# EAGLE design AJH_module_tester-v1_00 (EAGLE 9.6.2)

## Sheet 1 of 4
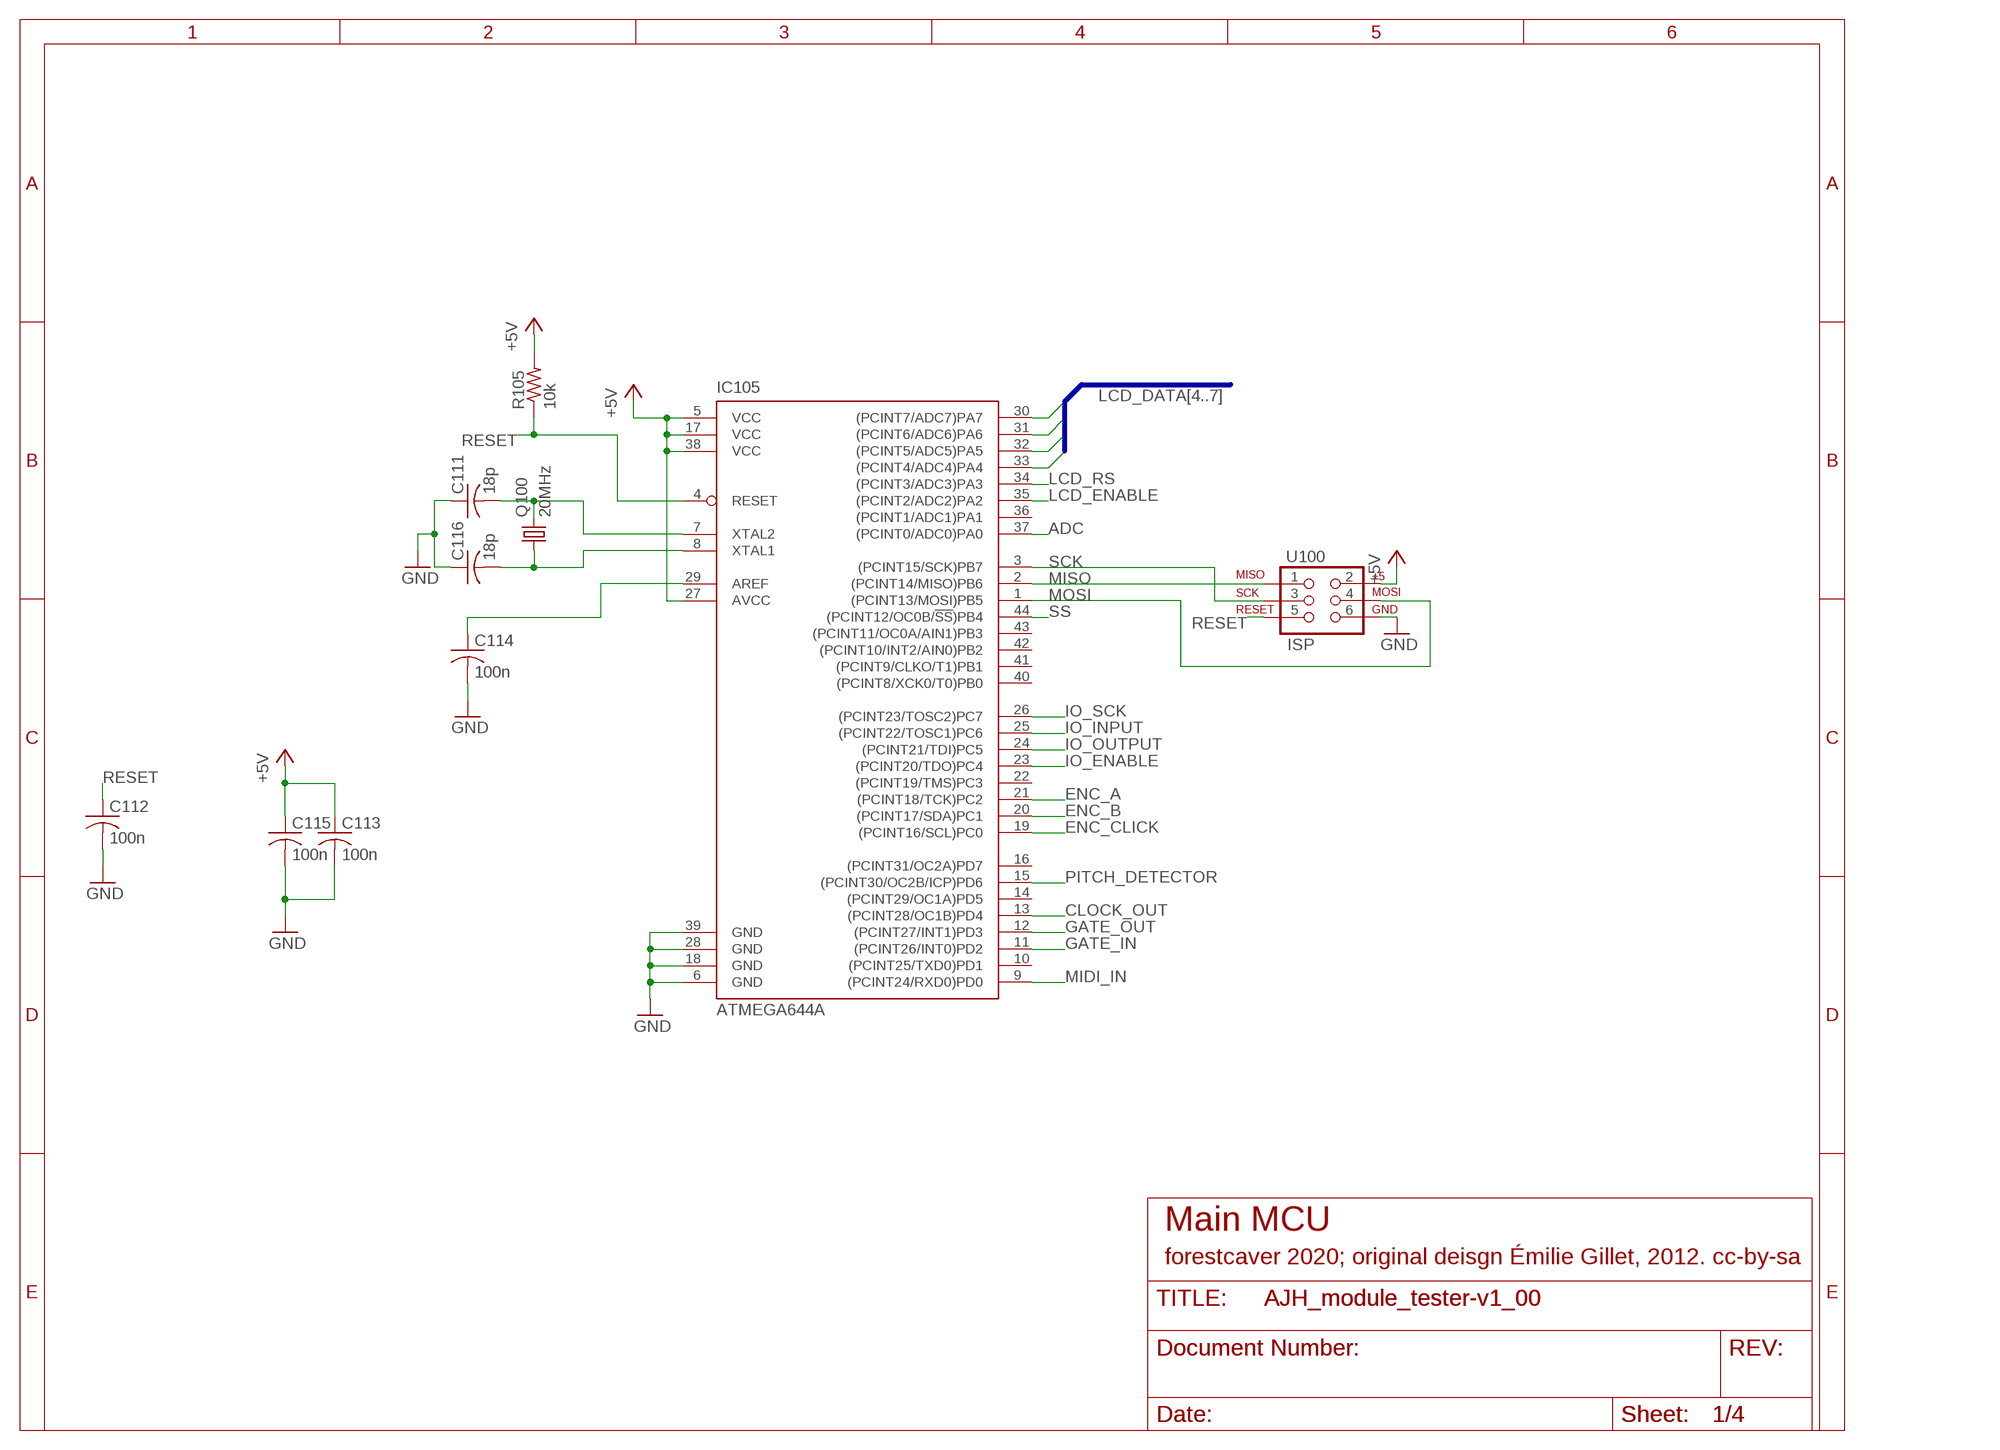
[diagram p0: schematic, sheet 1]

### Parts
C111  18p  C-USC0603  [C0603]
C112  100n  C-USC0603  [C0603]
C113  100n  C-USC0603  [C0603]
C114  100n  C-USC0603  [C0603]
C115  100n  C-USC0603  [C0603]
C116  18p  C-USC0603  [C0603]
IC105  ATMEGA644A  [TQFP44]
Q100  20MHz  CRYSTALHC49UP  [HC49UP]
R105  10k  R-US_R0603  [R0603]
U100  ISP  AVR_SPI_PRG_6PTH  [2X3]

### Nets
+5V: C113.1 C115.1 IC105.5(VCC) IC105.17(VCC) IC105.27(AVCC) IC105.38(VCC) R105.2 U100.2 ; also sheet 2,3,4
ADC: IC105.37((PCINT0/ADC0)PA0) ; also sheet 3
CLOCK_OUT: IC105.13((PCINT28/OC1B)PD4) ; also sheet 2
ENC_A: IC105.21((PCINT18/TCK)PC2) ; also sheet 2
ENC_B: IC105.20((PCINT17/SDA)PC1) ; also sheet 2
ENC_CLICK: IC105.19((PCINT16/SCL)PC0) ; also sheet 2
GATE_IN: IC105.11((PCINT26/INT0)PD2) ; also sheet 2
GATE_OUT: IC105.12((PCINT27/INT1)PD3) ; also sheet 2
GND: C111.1 C112.2 C113.2 C114.2 C115.2 C116.1 IC105.6(GND) IC105.18(GND) IC105.28(GND) IC105.39(GND) U100.6 ; also sheet 2,3,4
IO_ENABLE: IC105.23((PCINT20/TDO)PC4) ; also sheet 2
IO_INPUT: IC105.25((PCINT22/TOSC1)PC6) ; also sheet 2
IO_OUTPUT: IC105.24((PCINT21/TDI)PC5) ; also sheet 2
IO_SCK: IC105.26((PCINT23/TOSC2)PC7) ; also sheet 2
LCD_DATA4: IC105.33((PCINT4/ADC4)PA4) ; also sheet 2
LCD_DATA5: IC105.32((PCINT5/ADC5)PA5) ; also sheet 2
LCD_DATA6: IC105.31((PCINT6/ADC6)PA6) ; also sheet 2
LCD_DATA7: IC105.30((PCINT7/ADC7)PA7) ; also sheet 2
LCD_ENABLE: IC105.35((PCINT2/ADC2)PA2) ; also sheet 2
LCD_RS: IC105.34((PCINT3/ADC3)PA3) ; also sheet 2
MIDI_IN: IC105.9((PCINT24/RXD0)PD0) ; also sheet 2
MISO: IC105.2((PCINT14/MISO)PB6) U100.1
MOSI: IC105.1((PCINT13/MOSI)PB5) U100.4 ; also sheet 3
N$4: C116.2 IC105.8(XTAL1) Q100.1
N$20: C111.2 IC105.7(XTAL2) Q100.2
N$22: C114.1 IC105.29(AREF)
PITCH_DETECTOR: IC105.15((PCINT30/OC2B/ICP)PD6) ; also sheet 3
RESET: C112.1 IC105.4(RESET) R105.1 U100.5
SCK: IC105.3((PCINT15/SCK)PB7) U100.3 ; also sheet 3
SS: IC105.44((PCINT12/OC0B/!SS!)PB4) ; also sheet 3
Unconnected: IC105.10((PCINT25/TXD0)PD1) IC105.14((PCINT29/OC1A)PD5) IC105.16((PCINT31/OC2A)PD7) IC105.22((PCINT19/TMS)PC3) IC105.36((PCINT1/ADC1)PA1) IC105.40((PCINT8/XCK0/T0)PB0) IC105.41((PCINT9/CLKO/T1)PB1) IC105.42((PCINT10/INT2/AIN0)PB2) IC105.43((PCINT11/OC0A/AIN1)PB3)

### Buses
LCD_DATA[4..7]

### Notes on the sheet
- Main MCU
- forestcaver 2020; original deisgn Émilie Gillet, 2012. cc-by-sa

## Sheet 2 of 4
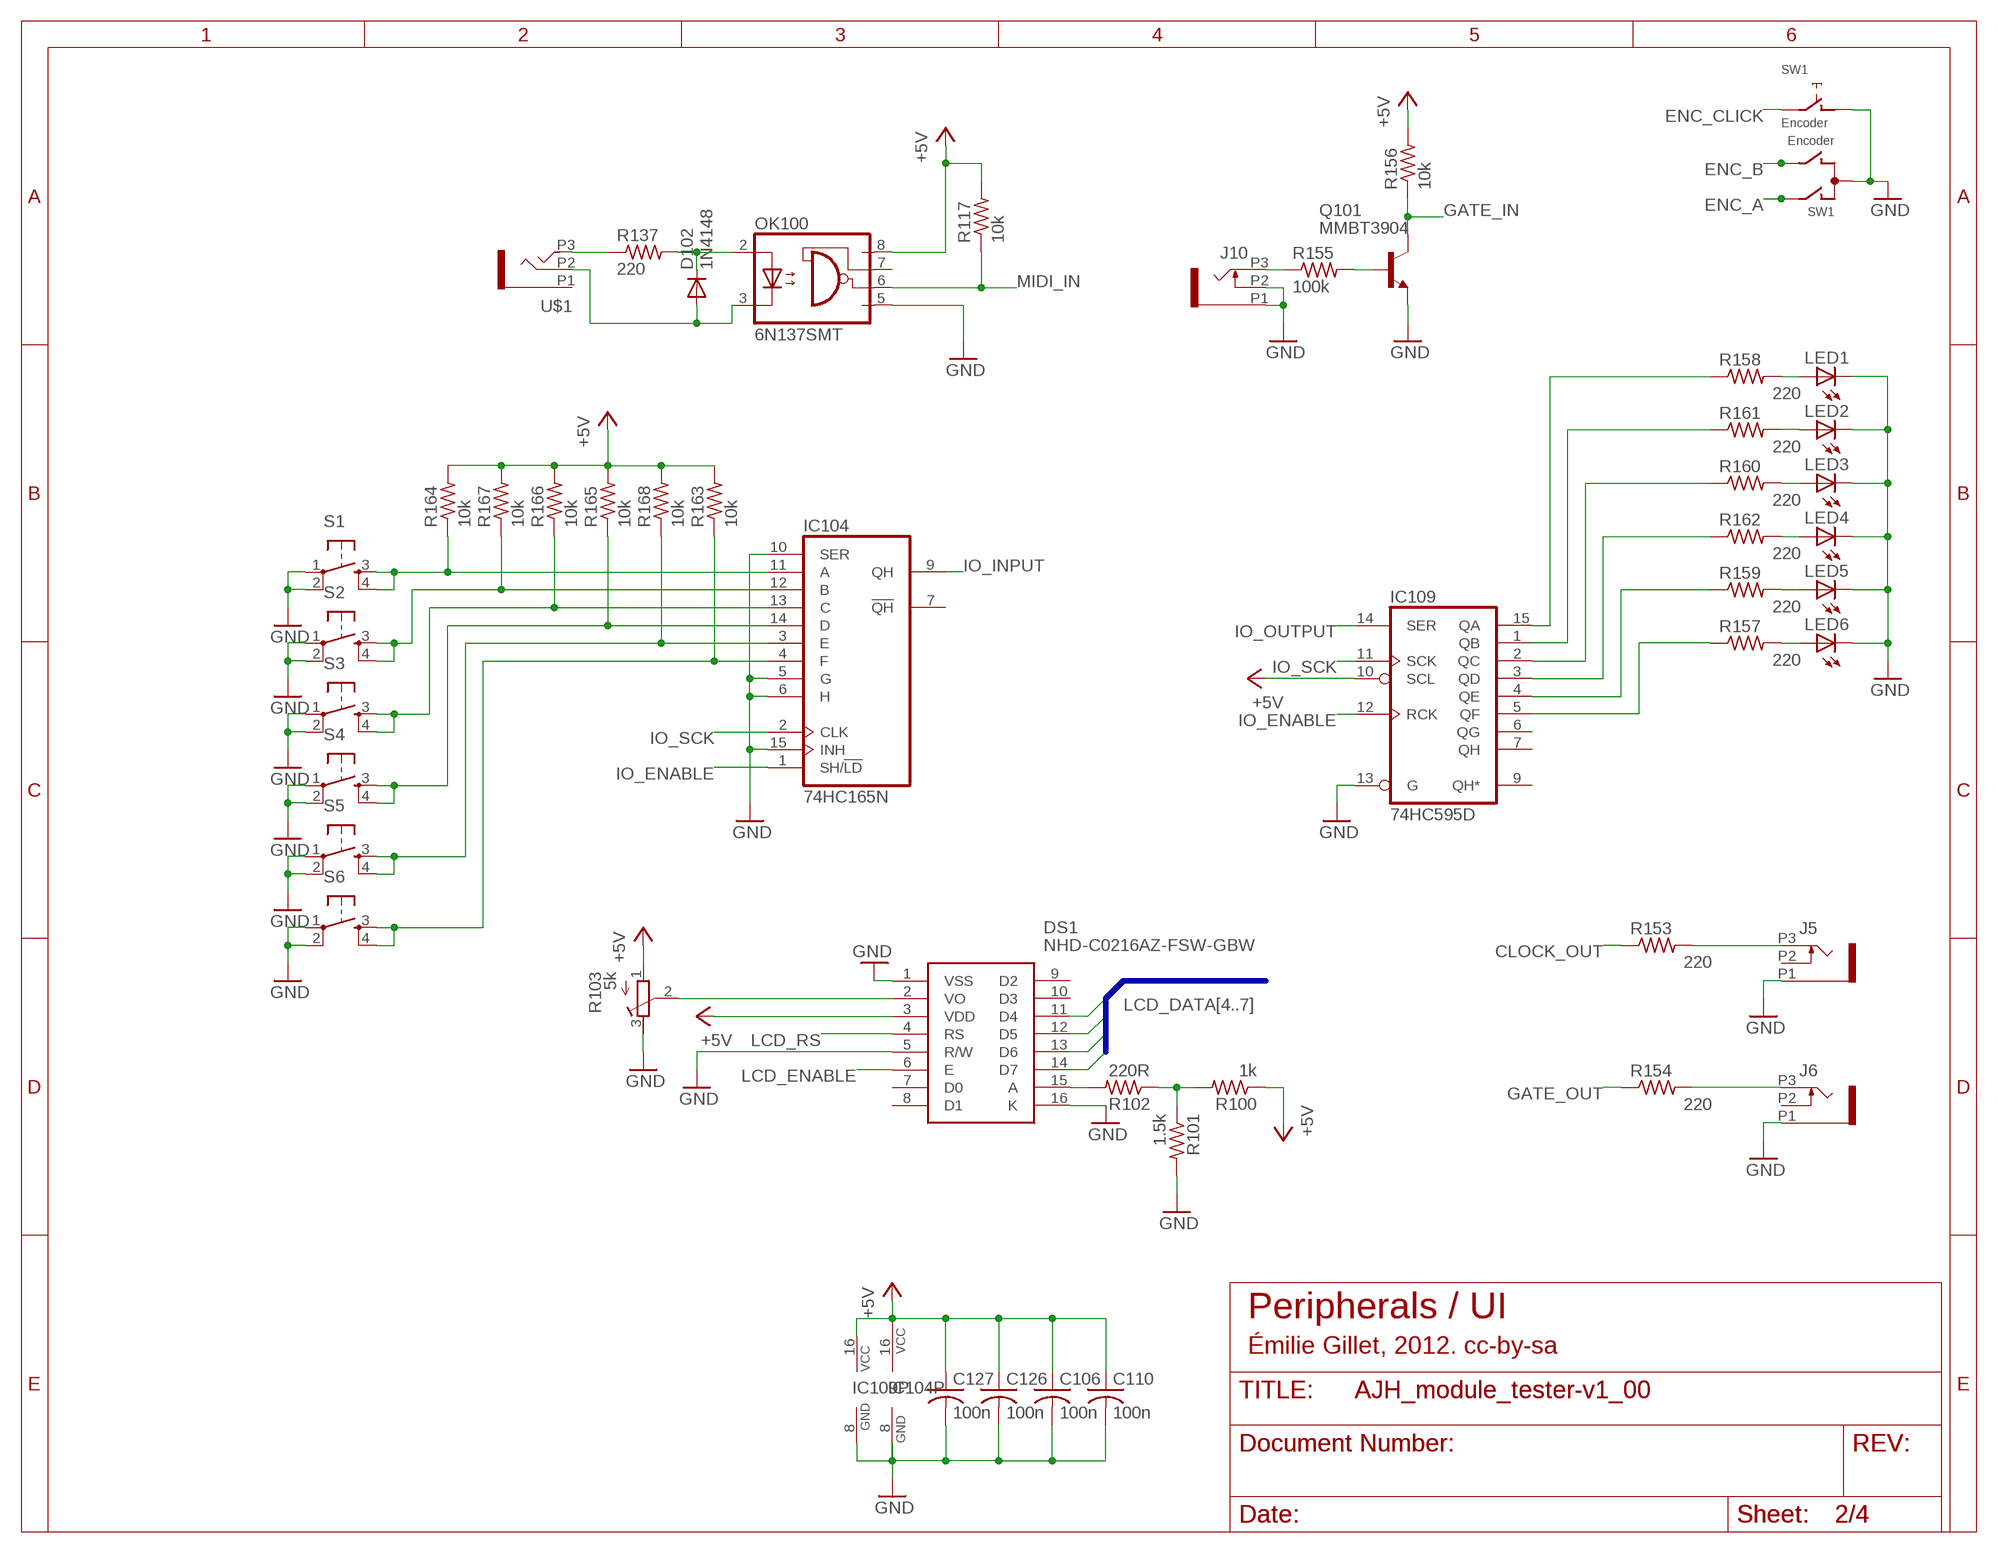
[diagram p1: schematic, sheet 2]

### Parts
C106  100n  C-USC0603  [C0603]
C110  100n  C-USC0603  [C0603]
C126  100n  C-USC0603  [C0603]
C127  100n  C-USC0603  [C0603]
D102  1N4148  DIODE-SOD123  [SOD123]
DS1  NHD-C0216AZ-FSW-GBW  [NHDC0216AZFSWGBW]
IC104  74HC165N  74LS165D  [SO16]
IC109  74HC595D  [SO16]
J5  PJ301_THONKICONN6  [WQP_PJ_301M6]
J6  PJ301_THONKICONN6  [WQP_PJ_301M6]
J10  PJ301_THONKICONN6  [WQP_PJ_301M6]
LED1  LED3MM  [LED3MM]
LED2  LED3MM  [LED3MM]
LED3  LED3MM  [LED3MM]
LED4  LED3MM  [LED3MM]
LED5  LED3MM  [LED3MM]
LED6  LED3MM  [LED3MM]
OK100  6N137SMT  [DIL8-SMD]
Q101  MMBT3904  MMBT3904LT1-NPN-SOT23-BEC  [SOT23-BEC]
R100  1k  R-US_R0603  [R0603]
R101  1.5k  R-US_R0603  [R0603]
R102  220R  R-US_R0603  [R0603]
R103  5k  R-TRIMM3339P  [RTRIM3339P]
R117  10k  R-US_R0603  [R0603]
R137  220  R-US_R0603  [R0603]
R153  220  R-US_R0603  [R0603]
R154  220  R-US_R0603  [R0603]
R155  100k  R-US_R0603  [R0603]
R156  10k  R-US_R0603  [R0603]
R157  220  R-US_R0603  [R0603]
R158  220  R-US_R0603  [R0603]
R159  220  R-US_R0603  [R0603]
R160  220  R-US_R0603  [R0603]
R161  220  R-US_R0603  [R0603]
R162  220  R-US_R0603  [R0603]
R163  10k  R-US_R0603  [R0603]
R164  10k  R-US_R0603  [R0603]
R165  10k  R-US_R0603  [R0603]
R166  10k  R-US_R0603  [R0603]
R167  10k  R-US_R0603  [R0603]
R168  10k  R-US_R0603  [R0603]
S1  TAC_SWITCHPTH  [TACTILE-PTH]
S2  TAC_SWITCHPTH  [TACTILE-PTH]
S3  TAC_SWITCHPTH  [TACTILE-PTH]
S4  TAC_SWITCHPTH  [TACTILE-PTH]
S5  TAC_SWITCHPTH  [TACTILE-PTH]
S6  TAC_SWITCHPTH  [TACTILE-PTH]
SW1  Encoder  EC12E_SW  [ALPS_EC12E_SW]
U$1  PJ366ST  [WQP_PJ_301M8]

### Nets
+5V: C106.1 C110.1 C126.1 C127.1 DS1.3(VDD) IC104.16(VCC) IC109.10(SCL) IC109.16(VCC) OK100.8(VCC) R100.1 R103.1(E) R117.2 R156.2 R163.2 R164.2 R165.2 R166.2 R167.2 R168.2 ; also sheet 1,3,4
CLOCK_OUT: R153.1 ; also sheet 1
ENC_A: SW1.A ; also sheet 1
ENC_B: SW1.B ; also sheet 1
ENC_CLICK: SW1.E ; also sheet 1
GATE_IN: Q101.C R156.1 ; also sheet 1
GATE_OUT: R154.1 ; also sheet 1
GND: C106.2 C110.2 C126.2 C127.2 DS1.1(VSS) DS1.5(R/W) DS1.16(K) IC104.5(G) IC104.6(H) IC104.8(GND) IC104.10(SER) IC104.15(INH) IC109.8(GND) IC109.13(G) J5.P1 J6.P1 J10.P1 J10.P2 LED1.K(C) LED2.K(C) LED3.K(C) LED4.K(C) LED5.K(C) LED6.K(C) OK100.5(GND) Q101.E R101.2 R103.3(A) S1.1 S1.2 S2.1 S2.2 S3.1 S3.2 S4.1 S4.2 S5.1 S5.2 S6.1 S6.2 SW1.C SW1.D ; also sheet 1,3,4
IO_ENABLE: IC104.1(SH/!LD) IC109.12(RCK) ; also sheet 1
IO_INPUT: IC104.9(QH) ; also sheet 1
IO_OUTPUT: IC109.14(SER) ; also sheet 1
IO_SCK: IC104.2(CLK) IC109.11(SCK) ; also sheet 1
LCD_DATA4: DS1.11(D4) ; also sheet 1
LCD_DATA5: DS1.12(D5) ; also sheet 1
LCD_DATA6: DS1.13(D6) ; also sheet 1
LCD_DATA7: DS1.14(D7) ; also sheet 1
LCD_ENABLE: DS1.6(E) ; also sheet 1
LCD_RS: DS1.4(RS) ; also sheet 1
MIDI_IN: OK100.6(VO) R117.1 ; also sheet 1
N$1: IC109.2(QC) R160.1
N$2: IC109.4(QE) R159.1
N$3: LED5.A R159.2
N$5: J10.P3 R155.1
N$7: R137.1 U$1.P3
N$9: IC104.3(E) R168.1 S5.3 S5.4
N$11: J5.P3 R153.2
N$12: IC104.4(F) R163.1 S6.3 S6.4
N$13: IC104.14(D) R165.1 S4.3 S4.4
N$14: J6.P3 R154.2
N$19: LED6.A R157.2
N$21: IC109.5(QF) R157.1
N$24: IC104.11(A) R164.1 S1.3 S1.4
N$25: DS1.15(A) R102.2
N$28: D102.C OK100.2(A) R137.2
N$30: IC109.15(QA) R158.1
N$31: IC109.1(QB) R161.1
N$33: IC109.3(QD) R162.1
N$34: DS1.2(VO) R103.2(S)
N$42: LED1.A R158.2
N$43: LED2.A R161.2
N$44: LED3.A R160.2
N$45: LED4.A R162.2
N$60: R100.2 R101.1 R102.1
N$66: Q101.B R155.2
N$73: D102.A OK100.3(C) U$1.P2
N$88: IC104.12(B) R167.1 S2.3 S2.4
N$90: IC104.13(C) R166.1 S3.3 S3.4
Unconnected: DS1.7(D0) DS1.8(D1) DS1.9(D2) DS1.10(D3) IC104.7(!QH) IC109.6(QG) IC109.7(QH) IC109.9(QH*) J5.P2 J6.P2 OK100.7(VE) SW1.GND1(G) SW1.GND2(G) U$1.P1

### Buses
LCD_DATA[4..7]

### Notes on the sheet
- Peripherals / UI
- Émilie Gillet, 2012. cc-by-sa

## Sheet 3 of 4
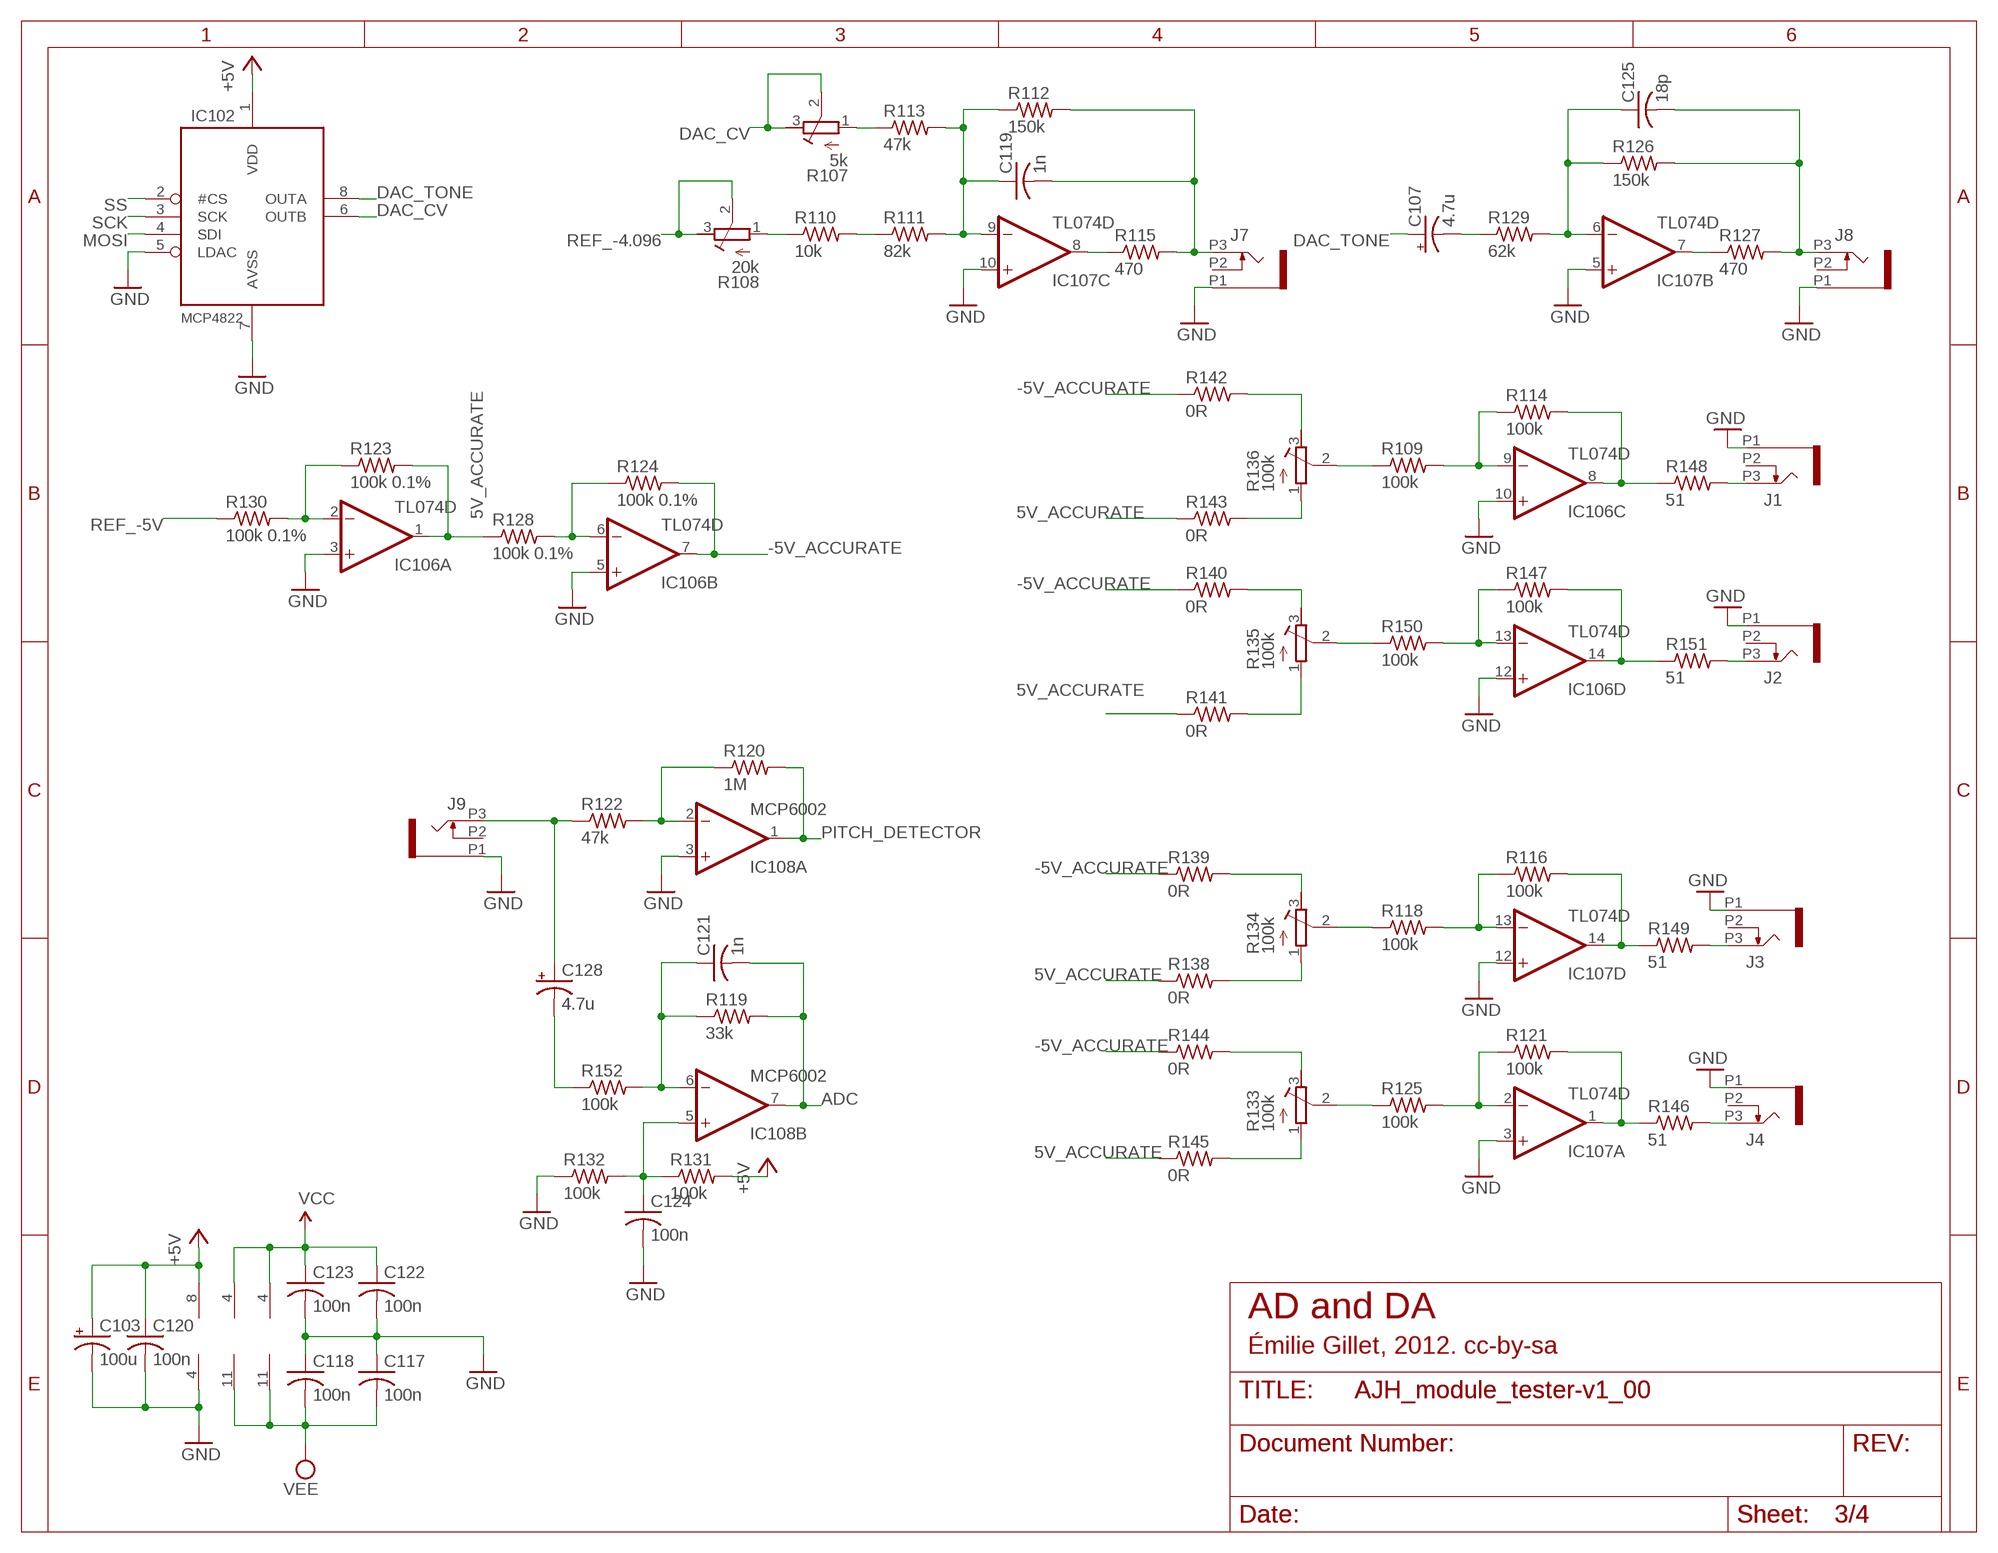
[diagram p2: schematic, sheet 3]

### Parts
C103  100u  CPOL-USC  [PANASONIC_C]
C107  4.7u  CPOL-USB  [PANASONIC_B]
C117  100n  C-USC0603  [C0603]
C118  100n  C-USC0603  [C0603]
C119  1n  C-USC0603  [C0603]
C120  100n  C-USC0603  [C0603]
C121  1n  C-USC0603  [C0603]
C122  100n  C-USC0603  [C0603]
C123  100n  C-USC0603  [C0603]
C124  100n  C-USC0603  [C0603]
C125  18p  C-USC0603  [C0603]
C128  4.7u  CPOL-USB  [PANASONIC_B]
IC102  MCP4822SO08  [SO08]
IC106  TL074D  [SO14]
IC107  TL074D  [SO14]
IC108  MCP6002  TL072D  [SO08]
J1  PJ301_THONKICONN6  [WQP_PJ_301M6]
J2  PJ301_THONKICONN6  [WQP_PJ_301M6]
J3  PJ301_THONKICONN6  [WQP_PJ_301M6]
J4  PJ301_THONKICONN6  [WQP_PJ_301M6]
J7  PJ301_THONKICONN6  [WQP_PJ_301M6]
J8  PJ301_THONKICONN6  [WQP_PJ_301M6]
J9  PJ301_THONKICONN6  [WQP_PJ_301M6]
R107  5k  R-TRIMM3296W  [RTRIM3296W]
R108  20k  R-TRIMM3296W  [RTRIM3296W]
R109  100k  R-US_R0603  [R0603]
R110  10k  R-US_R0603  [R0603]
R111  82k  R-US_R0603  [R0603]
R112  150k  R-US_R0603  [R0603]
R113  47k  R-US_R0603  [R0603]
R114  100k  R-US_R0603  [R0603]
R115  470  R-US_R0603  [R0603]
R116  100k  R-US_R0603  [R0603]
R118  100k  R-US_R0603  [R0603]
R119  33k  R-US_R0603  [R0603]
R120  1M  R-US_R0603  [R0603]
R121  100k  R-US_R0603  [R0603]
R122  47k  R-US_R0603  [R0603]
R123  100k 0.1%  R-US_R0603  [R0603]
R124  100k 0.1%  R-US_R0603  [R0603]
R125  100k  R-US_R0603  [R0603]
R126  150k  R-US_R0603  [R0603]
R127  470  R-US_R0603  [R0603]
R128  100k 0.1%  R-US_R0603  [R0603]
R129  62k  R-US_R0603  [R0603]
R130  100k 0.1%  R-US_R0603  [R0603]
R131  100k  R-US_R0603  [R0603]
R132  100k  R-US_R0603  [R0603]
R133  100k  R-TRIMM3296W  [RTRIM3296W]
R134  100k  R-TRIMM3296W  [RTRIM3296W]
R135  100k  R-TRIMM3296W  [RTRIM3296W]
R136  100k  R-TRIMM3296W  [RTRIM3296W]
R138  0R  R-US_R0603  [R0603]
R139  0R  R-US_R0603  [R0603]
R140  0R  R-US_R0603  [R0603]
R141  0R  R-US_R0603  [R0603]
R142  0R  R-US_R0603  [R0603]
R143  0R  R-US_R0603  [R0603]
R144  0R  R-US_R0603  [R0603]
R145  0R  R-US_R0603  [R0603]
R146  51  R-US_R0603  [R0603]
R147  100k  R-US_R0603  [R0603]
R148  51  R-US_R0603  [R0603]
R149  51  R-US_R0603  [R0603]
R150  100k  R-US_R0603  [R0603]
R151  51  R-US_R0603  [R0603]
R152  100k  R-US_R0603  [R0603]

### Nets
5V_ACCURATE: IC106.1(A:OUT) R123.2 R128.1 R138.1 R141.1 R143.1 R145.1
+5V: C103.+ C120.1 IC102.1(VDD) IC108.8(P:V+) R131.2 ; also sheet 1,2,4
-5V_ACCURATE: IC106.7(B:OUT) R124.2 R139.1 R140.1 R142.1 R144.1
ADC: C121.2 IC108.7(B:OUT) R119.2 ; also sheet 1
DAC_CV: IC102.6(OUTB) R107.2(S) R107.3(A)
DAC_TONE: C107.+ IC102.8(OUTA)
GND: C103.- C117.1 C118.1 C120.2 C122.2 C123.2 C124.2 IC102.5(LDAC) IC102.7(AVSS) IC106.3(A:+IN) IC106.5(B:+IN) IC106.10(C:+IN) IC106.12(D:+IN) IC107.3(A:+IN) IC107.5(B:+IN) IC107.10(C:+IN) IC107.12(D:+IN) IC108.3(A:+IN) IC108.4(P:V-) J1.P1 J2.P1 J3.P1 J4.P1 J7.P1 J8.P1 J9.P1 R132.1 ; also sheet 1,2,4
MOSI: IC102.4(SDI) ; also sheet 1
N$6: C128.+ J9.P3 R122.1
N$8: IC107.8(C:OUT) R115.1
N$10: IC107.7(B:OUT) R127.1
N$15: IC107.2(A:-IN) R121.1 R125.2
N$16: J2.P3 R151.2
N$17: C107.- R129.1
N$18: J1.P3 R148.2
N$23: C125.1 IC107.6(B:-IN) R126.1 R129.2
N$26: C119.2 J7.P3 R112.2 R115.2
N$27: C119.1 IC107.9(C:-IN) R111.2 R112.1 R113.2
N$29: R107.1(E) R113.1
N$32: R108.1(E) R110.1
N$35: R110.2 R111.1
N$36: C124.1 IC108.5(B:+IN) R131.1 R132.2
N$37: IC108.2(A:-IN) R120.1 R122.2
N$38: C121.1 IC108.6(B:-IN) R119.1 R152.2
N$39: IC106.14(D:OUT) R147.2 R151.1
N$40: C128.- R152.1
N$41: IC107.14(D:OUT) R116.2 R149.1
N$46: IC106.9(C:-IN) R109.2 R114.1
N$47: IC106.8(C:OUT) R114.2 R148.1
N$48: IC106.13(D:-IN) R147.1 R150.2
N$49: IC106.2(A:-IN) R123.1 R130.2
N$50: IC106.6(B:-IN) R124.1 R128.2
N$51: IC107.13(D:-IN) R116.1 R118.2
N$52: R109.1 R136.2(S)
N$53: J3.P3 R149.2
N$54: J4.P3 R146.2
N$55: IC107.1(A:OUT) R121.2 R146.1
N$57: R135.2(S) R150.1
N$58: R125.1 R133.2(S)
N$59: R118.1 R134.2(S)
N$61: R136.3(A) R142.2
N$62: R136.1(E) R143.2
N$63: R135.3(A) R140.2
N$65: R135.1(E) R141.2
N$67: R134.3(A) R139.2
N$68: R134.1(E) R138.2
N$69: R133.3(A) R144.2
N$70: R133.1(E) R145.2
PITCH_DETECTOR: IC108.1(A:OUT) R120.2 ; also sheet 1
REF_-4.096: R108.2(S) R108.3(A) ; also sheet 4
REF_-5V: R130.1 ; also sheet 4
SCK: IC102.3(SCK) ; also sheet 1
SS: IC102.2(#CS) ; also sheet 1
TONE_OUT: C125.2 J8.P3 R126.2 R127.2
VCC: C122.1 C123.1 IC106.4(P:V+) IC107.4(P:V+) ; also sheet 4
VEE: C117.2 C118.2 IC106.11(P:V-) IC107.11(P:V-) ; also sheet 4
Unconnected: J1.P2 J2.P2 J3.P2 J4.P2 J7.P2 J8.P2 J9.P2

### Notes on the sheet
- AD and DA
- Émilie Gillet, 2012. cc-by-sa

## Sheet 4 of 4
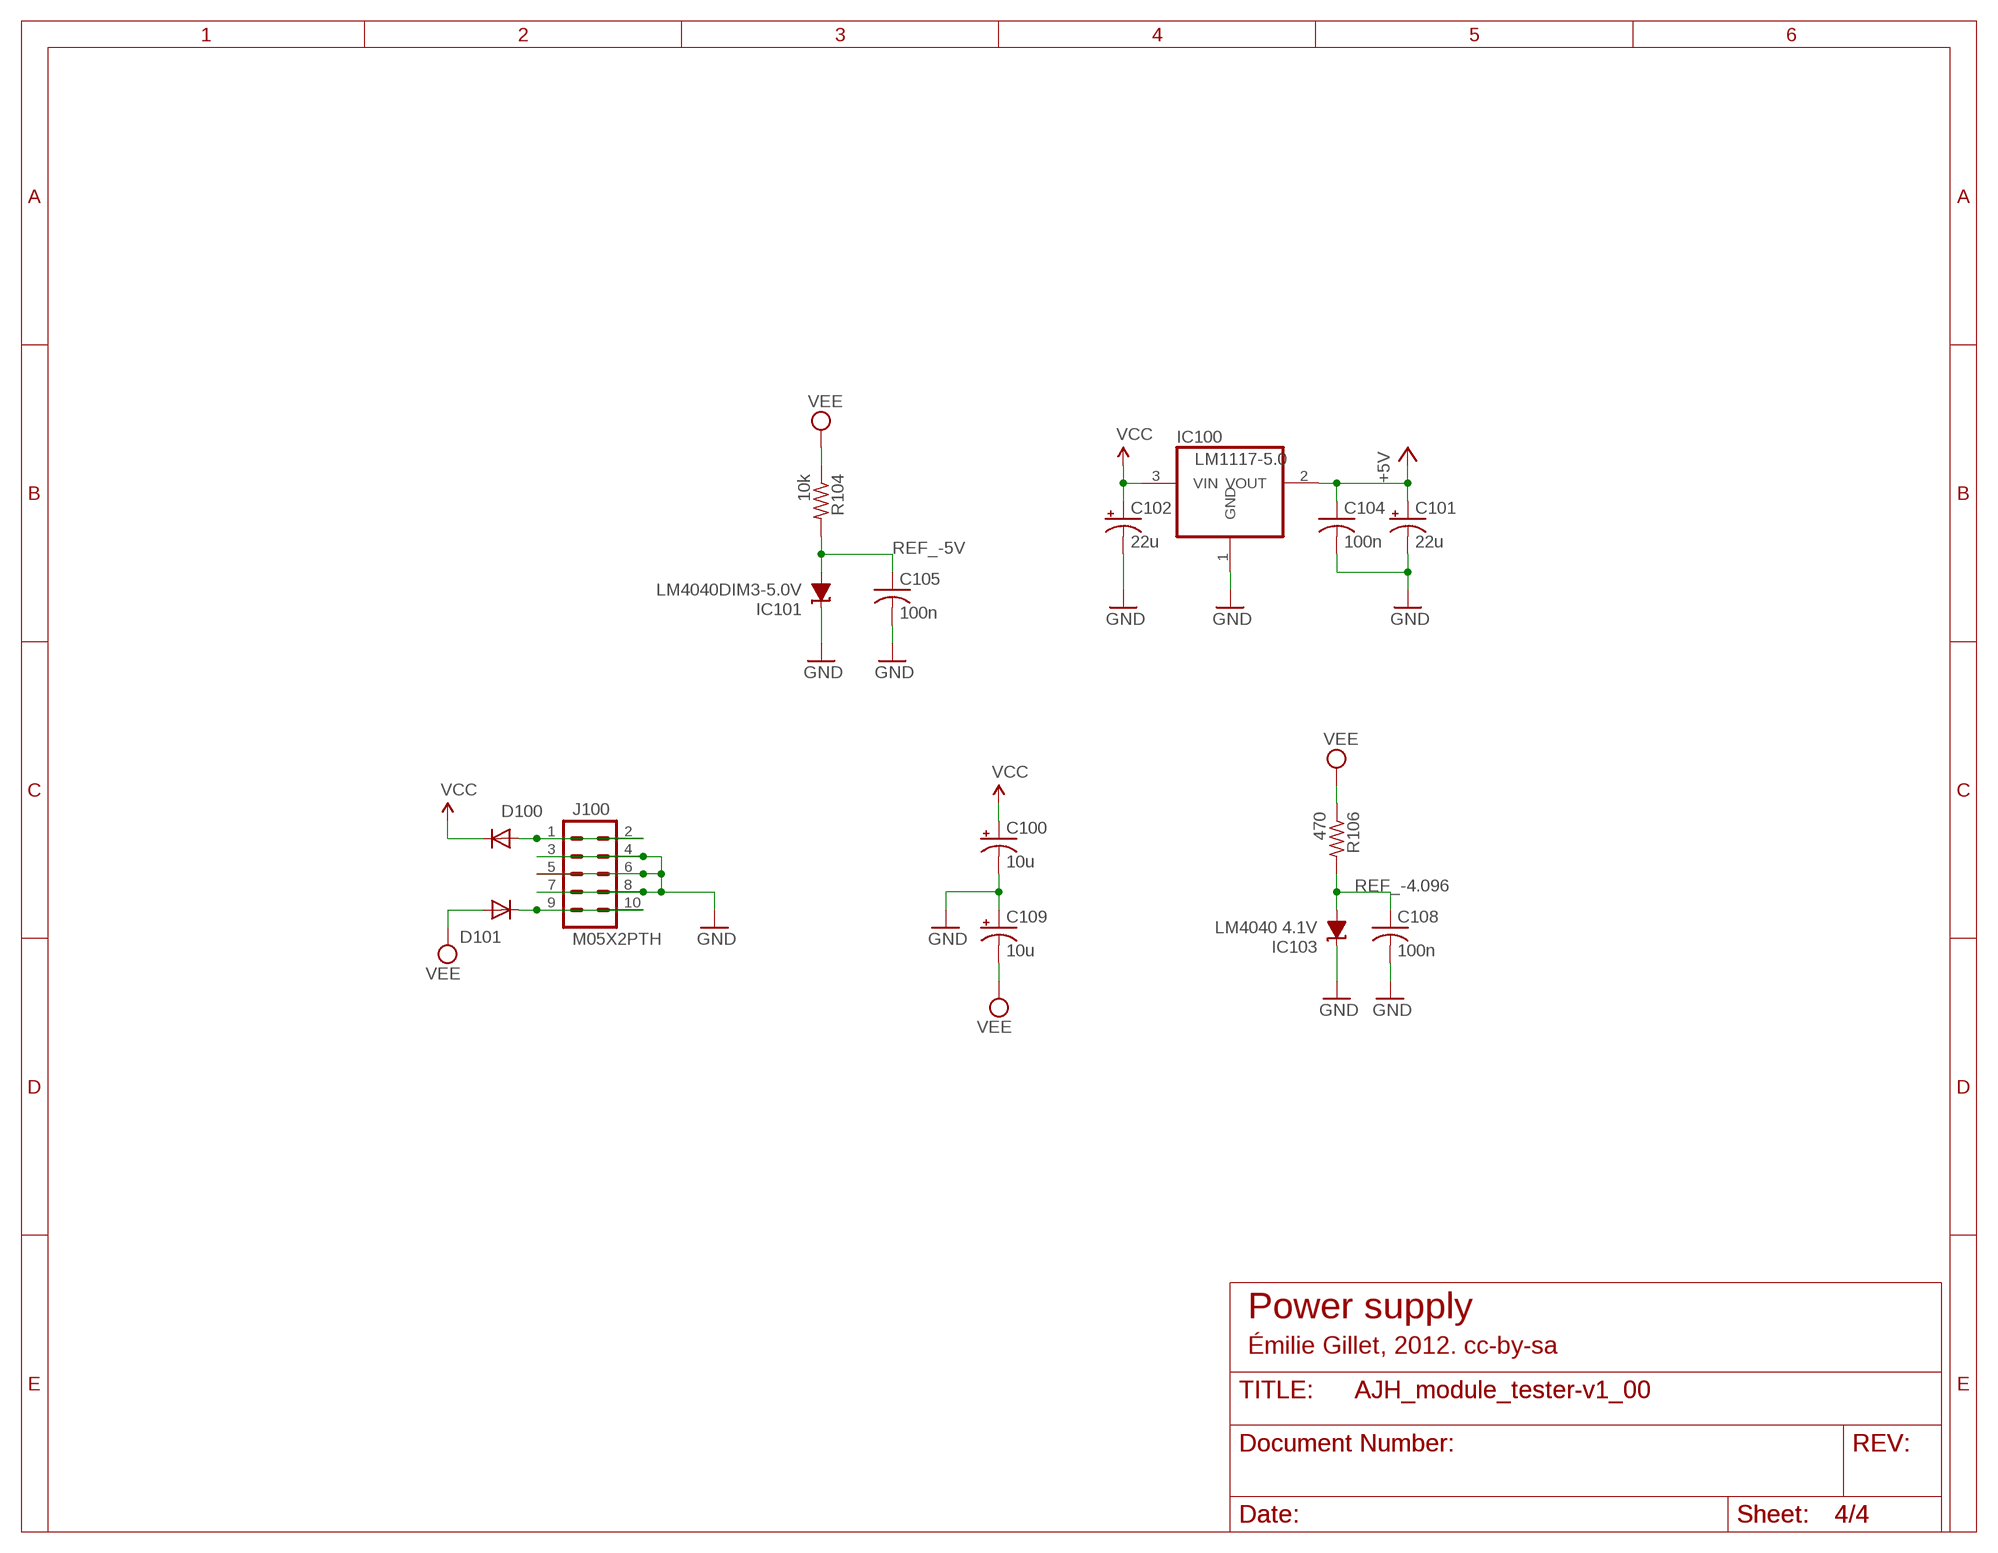
[diagram p3: schematic, sheet 4]

### Parts
C100  10u  CPOL-USB  [PANASONIC_B]
C101  22u  CPOL-USC  [PANASONIC_C]
C102  22u  CPOL-USC  [PANASONIC_C]
C104  100n  C-USC0603  [C0603]
C105  100n  C-USC0603  [C0603]
C108  100n  C-USC0603  [C0603]
C109  10u  CPOL-USB  [PANASONIC_B]
D100  1N5819HW  DIODE-SOD123  [SOD123]
D101  1N5819HW  DIODE-SOD123  [SOD123]
IC100  LM1117-5.0  REG1117  [SOT223]
IC101  LM4040DIM3-5.0V  LM4041C12DBZ  [DBZ_R-PDSO-G3]
IC103  LM4040 4.1V  LM4041C12DBZ  [DBZ_R-PDSO-G3]
J100  M05X2PTH  [AVR_ICSP]
R104  10k  R-US_R0603  [R0603]
R106  470  R-US_R0603  [R0603]

### Nets
+5V: C101.+ C104.1 IC100.2(VOUT) ; also sheet 1,2,3
GND: C100.- C101.- C102.- C104.2 C105.2 C108.2 C109.+ IC100.1(GND) IC101.1(C) IC103.1(C) J100.3 J100.4 J100.5 J100.6 J100.7 J100.8 ; also sheet 1,2,3
N$56: D100.A J100.1 J100.2
N$64: D101.C J100.9 J100.10
REF_-4.096: C108.1 IC103.2(A) R106.2 ; also sheet 3
REF_-5V: C105.1 IC101.2(A) R104.2 ; also sheet 3
VCC: C100.+ C102.+ D100.C IC100.3(VIN) ; also sheet 3
VEE: C109.- D101.A R104.1 R106.1 ; also sheet 3

### Notes on the sheet
- Power supply
- Émilie Gillet, 2012. cc-by-sa

## Library data of the parts
C100 C103 C107 C109 C128 = rcl:CPOL-US: POLARIZED CAPACITOR, American symbol; SPICEPREFIX: C
C101 C102 = rcl:CPOL-US: POLARIZED CAPACITOR, American symbol
C104-C106 C108 C110-C127 = rcl:C-US: CAPACITOR, American symbol
D100-D102 = diode:DIODE-: DIODE
DS1 = NHD-C0216AZ-FSW-GBW:NHD-C0216AZ-FSW-GBW: LCD Character Display Modules & Accessories STN-GRAY Transfl 54.7 x 25.3 x 5.5 Source: Datasheet <https://componentsearchengine.com/Datasheets/1/NHD-C0216AZ-FSW-GBW.pdf>; DESCRIPTION: LCD Character Display Modules & Accessories STN-GRAY Transfl 54.7 x 25.3 x 5.5; HEIGHT: 5mm; MANUFACTURER_NAME: Newhaven Display; MANUFACTURER_PART_NUMBER: NHD-C0216AZ-FSW-GBW; MOUSER_PART_NUMBER: 763-C0216AZ-FSW-GBW; MOUSER_PRICE-STOCK: https://www.mouser.com/Search/Refine.aspx?Keyword=763-C0216AZ-FSW-GBW
IC100 = og-vreg:REG1117: 800mA and 1A Low Dropout (LDO) Positive Regulator 1.8V, 2.5V, 2.85V, 3.3V, 5V, and Adj
IC101 IC103 = texas:LM4041: PRECISION MICROPOWER SHUNT VOLTAGE REFERENCE Source: http://focus.ti.com/lit/ds/slcs146e/slcs146e.pdf
IC102 = og-dac:MCP4822
IC104 = 74xx-us:74*165: 8-bit parallel load SHIFT REGISTER
IC105 = atmel:ATMEGA644: 8-bit Microcontroller with 64K Bytes In-System Programmable Flash Source: http://www.atmel.com/dyn/resources/prod_documents/doc2593.pdf; MPN: ATMEGA644PV-10AU; OC_FARNELL: 1455123; OC_NEWARK: 58M3748
IC106 IC107 = linear:TL074: OP AMP
IC108 = og-linear:TL072: OP AMP
IC109 = 74xx-eu:74*595: 8-bit SHIFT REGISTER, output latch
J1-J10 = og-pj301:PJ301_THONKICONN
J100 = og-header:M05X2: Header 5x2 Standard 10-pin dual row 0.1" header. Commonly used with AVR-ISP. Use with Spark Fun Electronics SKU: PRT-00778
LED1-LED6 = led:LED: LED OSRAM: - CHIPLED LG R971, LG N971, LY N971, LG Q971, LY Q971, LO R971, LY R971 LH N974, LH R974 LS Q976, LO Q976, LY Q976 LO Q996 - Hyper CHIPLED LW Q18S LB Q993, LB Q99A, LB R99A - SideLED LS A670, LO A670, LY A670, LG A670, LP A670 LB A673, LV A673, LT A673, LW A673 LH A674 LY A675 LS A676, LA A676, LO A676, LY A676, LW A676 LS A679, LY A679, LG A679 - Hyper Micro SIDELED® LS Y876, LA Y876, LO Y876, LY Y876 LT Y87S - SmartLED LW L88C, LW L88S LB L89C, LB L89S, LG L890 LS L89K, LO L89K, LY L89K LS L896, LA L896, LO L896, LY L896 - TOPLED LS T670, LO T670, LY T670, LG T670, LP T670 LSG T670, LSP T670, LSY T670, LOP T670, LYG T670 LG T671, LOG T671, LSG T671 LB T673, LV T673, LT T673, LW T673 LH T674 LS T676, LA T676, LO T676, LY T676, LB T676, LH T676, LSB T676, LW T676 LB T67C, LV T67C, LT T67C, LS T67K, LO T67K, LY T67K, LW E67C LS E67B, LA E67B, LO E67B, LY E67B, LB E67C, LV E67C, LT E67C LW T67C LS T679, LY T679, LG T679 LS T770, LO T770, LY T770, LG T770, LP T770 LB T773, LV T773, LT T773, LW T773 LH T774 LS E675, LA E675, LY E675, LS T675 LS T776, LA T776, LO T776, LY T776, LB T776 LHGB T686 LT T68C, LB T68C - Hyper Mini TOPLED® LB M676 - Mini TOPLED Santana® LG M470 LS M47K, LO M47K, LY M47K Source: http://www.osram.convergy.de LUXEON: - LUMILED® LXK2-PW12-R00, LXK2-PW12-S00, LXK2-PW14-U00, LXK2-PW14-V00 LXK2-PM12-R00, LXK2-PM12-S00, LXK2-PM14-U00 LXK2-PE12-Q00, LXK2-PE12-R00, LXK2-PE12-S00, LXK2-PE14-T00, LXK2-PE14-U00 LXK2-PB12-K00, LXK2-PB12-L00, LXK2-PB12-M00, LXK2-PB14-N00, LXK2-PB14-P00, LXK2-PB14-Q00 LXK2-PR12-L00, LXK2-PR12-M00, LXK2-PR14-Q00, LXK2-PR14-R00 LXK2-PD12-Q00, LXK2-PD12-R00, LXK2-PD12-S00 LXK2-PH12-R00, LXK2-PH12-S00 LXK2-PL12-P00, LXK2-PL12-Q00, LXK2-PL12-R00 Source: www.luxeon.com KINGBRIGHT: KA-3528ASYC Source: www.kingbright.com
OK100 = og-optocouplers:6N137: MOTOROLA OPTO COUPLER
Q100 = crystal:CRYSTAL: CRYSTAL
Q101 = transistor:*-NPN-: NPN Transistror BF959 corrected 2008.03.06
R100-R102 R105 R109-R132 R137-R168 = rcl:R-US_: RESISTOR, American symbol
R103 R107 R108 R133-R136 = rcl:R-TRIMM: Trimm resistor
R104 R106 = resistor:R-US_: RESISTOR, American symbol
S1-S6 = SparkFun:TAC_SWITCH: Momentary Switch Button commonly used for reset or general input. Spark Fun Electronics SKU : COM-00097
SW1 = switch-alps:EC12E_SW: ALPS rotary Encoder EC12E series with switch
U100 = SparkFun:AVR_SPI_PRG_6: AVR ISP 6 Pin This is the reduced ISP connector for AVR programming. Common on Arduino. This footprint will take up less PCB space and can be used with a 10-pin to 6-pin adapter such as SKU: BOB-08508
U$1 = AJHParts:PJ366ST

## Board
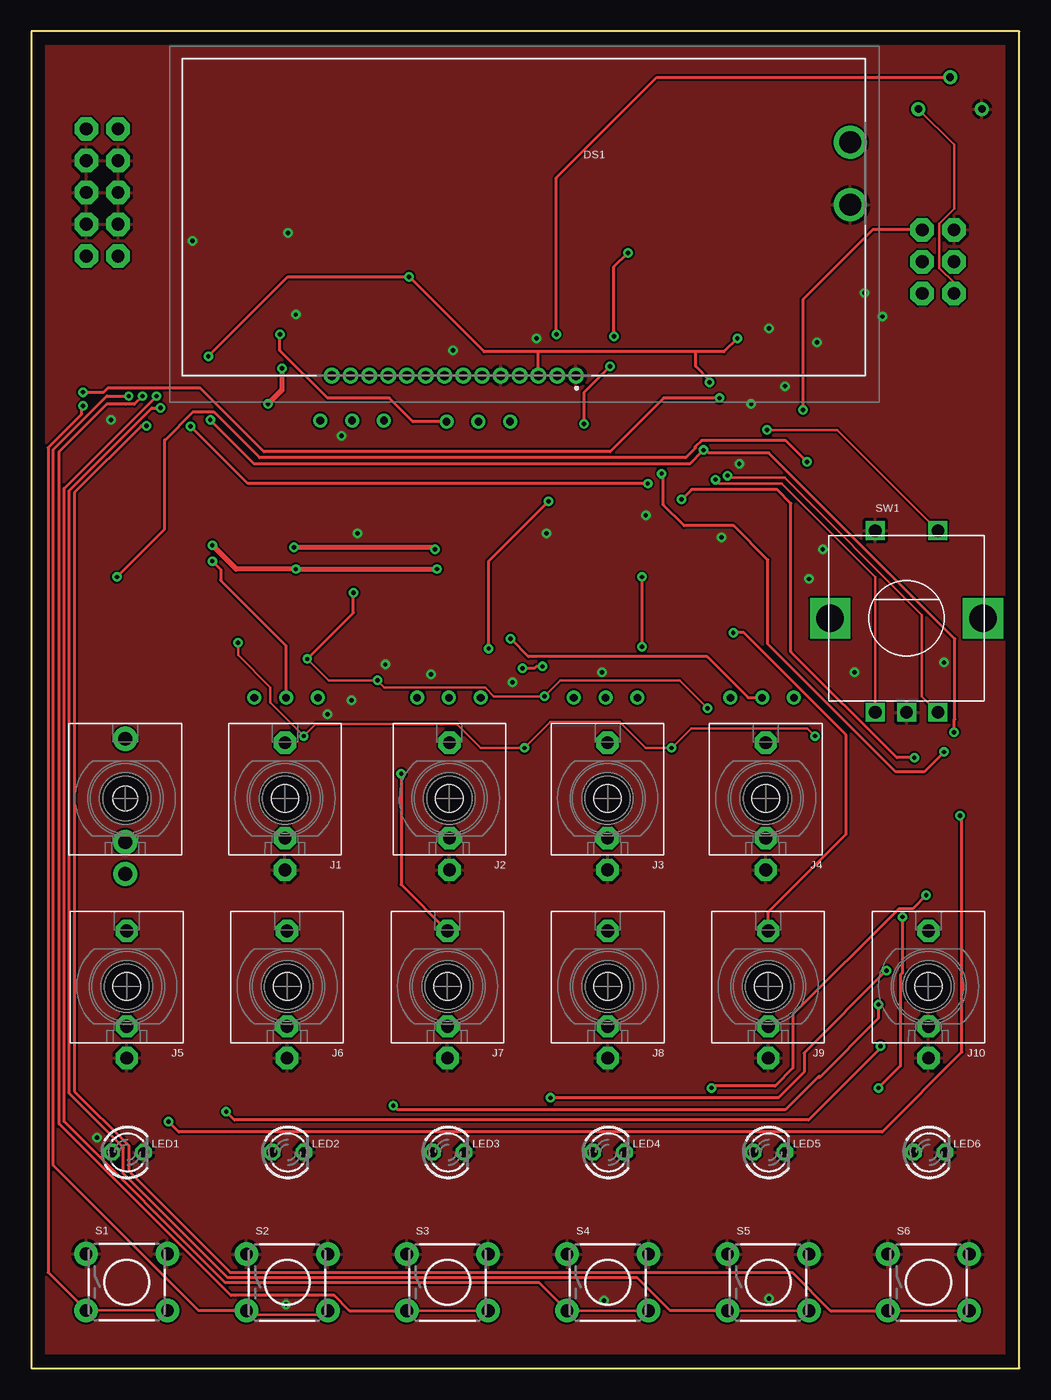
[diagram p4: board, top side]
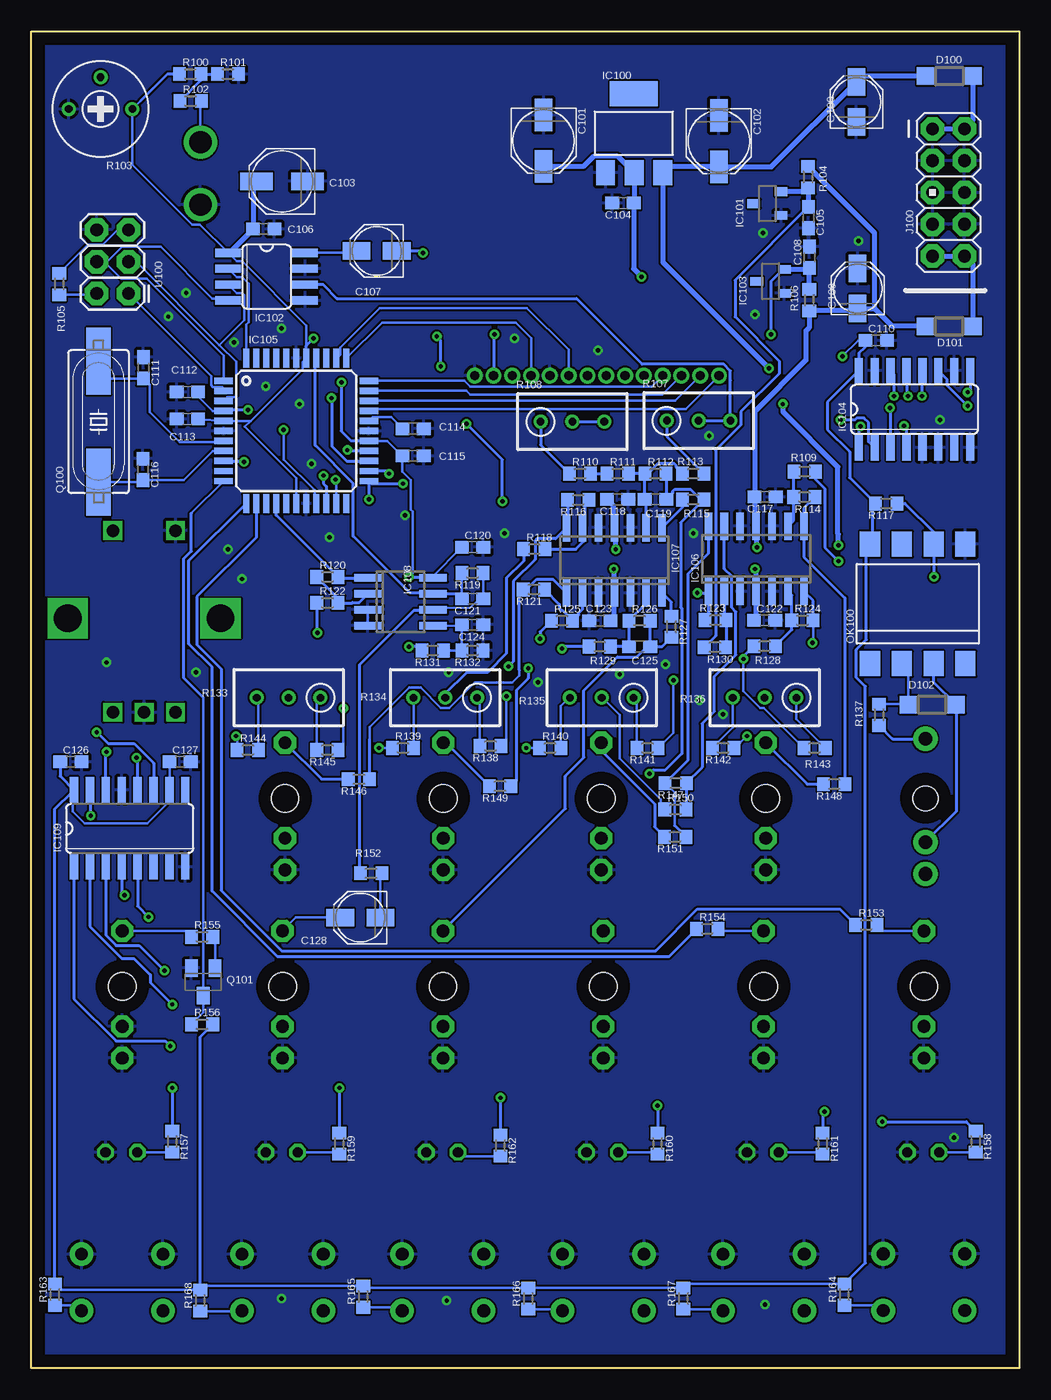
[diagram p5: board, bottom side, seen from below]

Size 78.88 x 106.76 mm. Coordinates in mm from the lower left corner, seen from the top.
Outline: 0,0 78.88,0 78.88,106.76 0,106.76 0,0
Copper layers (1*16): Top 0.035mm / dielectric 1.5mm / Bottom 0.035mm
Design rules "default": minimum track width 6mil, minimum drill 0.35mm, track to track 6mil, track to pad 6mil, pad to pad 6mil, via to via 6mil, smd to smd 6mil, copper to edge 40mil, drill to drill 6mil, minimum pad ring 10mil, minimum via ring 8mil, stop-mask expansion 4mil, vias tented up to drill 0mil, thermal gap 10mil

### Footprints (pad centres in the part's own frame; a part is rotated, then mirrored left to right if it is on the bottom)
PANASONIC_B = smd 2.2 x 1.4: + 1.6,0; - -1.6,0
PANASONIC_C = smd 2.6 x 1.4: + 2.05,0; - -2.05,0
C0603 = smd 1.1 x 1: 1 -0.85,0; 2 0.85,0
SOD123 = smd 1.4 x 1.4: A 1.9,0; C -1.9,0
NHDC0216AZFSWGBW = drill 0.74 pad 1.269: 1 4.111,-12.1; 2 2.611,-12.1; 3 1.111,-12.1; 4 -0.389,-12.1; 5 -1.889,-12.1; 6 -3.389,-12.1; 7 -4.889,-12.1; 8 -6.389,-12.1; 9 -7.889,-12.1; 10 -9.389,-12.1; 11 -10.889,-12.1; 12 -12.389,-12.1; 13 -13.889,-12.1; 14 -15.389,-12.1 | drill 1.77 pad 2.655: 15 26.011,6.55; 16 26.011,1.55
SOT223 = smd 1.499 x 2.007: 1 -2.261,-3.15; 2 0.025,-3.15; 3 2.311,-3.15 | smd 3.81 x 2.007: 4 0,3.15
DBZ_R-PDSO-G3 = smd 0.7 x 1: 1 -0.95,-1.1; 2 0.95,-1.1; 3 0,1.1
SO08 = smd 0.66 x 2.032: 1 -1.905,-3.073; 2 -0.635,-3.073; 3 0.635,-3.073; 4 1.905,-3.073; 5 1.905,3.073; 6 0.635,3.073; 7 -0.635,3.073; 8 -1.905,3.073
SO16 = smd 0.66 x 2.032: 1 -4.445,-3.073; 2 -3.175,-3.073; 3 -1.905,-3.073; 4 -0.635,-3.073; 5 0.635,-3.073; 6 1.905,-3.073; 7 3.175,-3.073; 8 4.445,-3.073; 9 4.445,3.073; 10 3.175,3.073; 11 1.905,3.073; 12 0.635,3.073; 13 -0.635,3.073; 14 -1.905,3.073; 15 -3.175,3.073; 16 -4.445,3.073
TQFP44 = smd 1.5 x 0.5: 1 -5.8,4; 2 -5.8,3.2; 3 -5.8,2.4; 4 -5.8,1.6; 5 -5.8,0.8; 6 -5.8,0; 7 -5.8,-0.8; 8 -5.8,-1.6; 9 -5.8,-2.4; 10 -5.8,-3.2; 11 -5.8,-4; 23 5.8,-4; 24 5.8,-3.2; 25 5.8,-2.4; 26 5.8,-1.6; 27 5.8,-0.8; 28 5.8,0; 29 5.8,0.8; 30 5.8,1.6; 31 5.8,2.4; 32 5.8,3.2; 33 5.8,4 | smd 0.5 x 1.5: 12 -4,-5.8; 13 -3.2,-5.8; 14 -2.4,-5.8; 15 -1.6,-5.8; 16 -0.8,-5.8; 17 0,-5.8; 18 0.8,-5.8; 19 1.6,-5.8; 20 2.4,-5.8; 21 3.2,-5.8; 22 4,-5.8; 34 4,5.8; 35 3.2,5.8; 36 2.4,5.8; 37 1.6,5.8; 38 0.8,5.8; 39 0,5.8; 40 -0.8,5.8; 41 -1.6,5.8; 42 -2.4,5.8; 43 -3.2,5.8; 44 -4,5.8
SO14 = smd 0.6 x 2.2: 1 -3.81,-2.6; 2 -2.54,-2.6; 3 -1.27,-2.6; 4 0,-2.6; 5 1.27,-2.6; 6 2.54,-2.6; 7 3.81,-2.6; 8 3.81,2.6; 9 2.54,2.6; 10 1.27,2.6; 11 0,2.6; 12 -1.27,2.6; 13 -2.54,2.6; 14 -3.81,2.6
SO08' = smd 0.6 x 2.2: 1 -1.905,-2.6; 2 -0.635,-2.6; 3 0.635,-2.6; 4 1.905,-2.6; 5 1.905,2.6; 6 0.635,2.6; 7 -0.635,2.6; 8 -1.905,2.6
WQP_PJ_301M6 = drill 1.016 pad 1.778 octagon: P1 0,-5.715; P2 0,-3.175; P3 0,4.445 | hole 2.2: 0,0
AVR_ICSP = drill 1.016 pad 1.88 octagon: 1 -1.27,5.08; 2 1.27,5.08; 3 -1.27,2.54; 4 1.27,2.54; 5 -1.27,0; 6 1.27,0; 7 -1.27,-2.54; 8 1.27,-2.54; 9 -1.27,-5.08; 10 1.27,-5.08
LED3MM = drill 0.813 octagon: A -1.27,0; K 1.27,0
DIL8-SMD = smd 1.6 x 2: 1 -3.81,-4.77; 2 -1.27,-4.77; 3 1.27,-4.77; 4 3.81,-4.77; 5 3.81,4.77; 6 1.27,4.77; 7 -1.27,4.77; 8 -3.81,4.77
HC49UP = smd 5.334 x 1.93: 1 -4.826,0; 2 4.826,0
SOT23-BEC = smd 1 x 1.4: B -0.95,-1.1; C 0,1.1; E 0.95,-1.1
R0603 = smd 1 x 1.1: 1 -0.85,0; 2 0.85,0
RTRIM3339P = drill 0.61: 1 -2.54,0; 2 0,-2.54; 3 2.54,0
RTRIM3296W = drill 0.61: 1 0,-2.54; 2 0,0; 3 0,2.54
TACTILE-PTH = drill 1.016 pad 1.88: 1 -3.251,2.261; 2 3.251,2.261; 3 -3.251,-2.261; 4 3.251,-2.261
ALPS_EC12E_SW = drill 1 square: A -2.5,-7.5; B 2.5,-7.5; C 0,-7.5; D -2.5,7; E 2.5,7 | drill 2.2 square: GND1 -6.1,0; GND2 6.1,0
2X3 = drill 1.016 pad 1.88 octagon: 1 0,0; 2 0,2.54; 3 2.54,0; 4 2.54,2.54; 5 5.08,0; 6 5.08,2.54
WQP_PJ_301M8 = drill 1.1 pad 1.93: P1 0,-6.032; P2 0,-3.493; P3 0,4.763 | hole 2: 0,0

### Placement (x,y rotation side)
C100  13.02,101.11 90 bottom
C101  37.99,98.02 270 bottom
C102  23.99,97.98 270 bottom
C103  58.87,94.77 180 bottom
C104  31.65,93.04 180 bottom
C105  16.85,91.89 270 bottom
C106  60.33,90.96 0 bottom
C107  51.31,89.22 180 bottom
C108  16.76,88.72 90 bottom
C109  12.91,86.22 90 bottom
C110  11.43,82.07 0 bottom
C111  69.92,79.89 270 bottom
C112  66.43,77.96 180 bottom
C113  66.42,75.8 180 bottom
C114  48.4,75.03 0 bottom
C115  48.41,72.84 0 bottom
C116  69.97,71.77 270 bottom
C117  20.3,69.58 180 bottom
C118  32.07,69.37 180 bottom
C119  29.05,69.37 0 bottom
C120  43.66,65.56 0 bottom
C121  43.66,61.44 180 bottom
C122  20.34,59.72 0 bottom
C123  33.5,59.69 180 bottom
C124  43.66,59.37 0 bottom
C125  30.32,57.63 0 bottom
C126  75.72,48.42 0 bottom
C127  66.99,48.42 0 bottom
C128  52.62,35.98 180 bottom
D100  5.59,103.18 0 bottom
D101  5.61,83.2 180 bottom
D102  6.96,52.99 0 bottom
DS1  39.37,91.36 0 top
IC100  30.78,98.61 0 bottom
IC101  20.12,93 90 bottom
IC102  60.09,87.17 270 bottom
IC103  19.87,86.79 90 bottom
IC104  8.38,76.57 0 bottom
IC105  57.73,74.85 0 bottom
IC106  21.02,64.64 0 bottom
IC107  32.33,64.51 0 bottom
IC108  MCP6002  [SO08']  49.41,61.2 270 bottom
IC109  71.03,43.1 0 bottom
J1  20.25,45.5 0 top
J2  33.38,45.5 0 top
J3  46,45.5 0 top
J4  58.62,45.5 0 top
J5  7.62,30.48 0 top
J6  20.42,30.48 0 top
J7  33.22,30.48 0 top
J8  46.02,30.48 0 top
J9  58.82,30.48 0 top
J10  71.62,30.48 0 top
J100  5.66,93.89 0 bottom
LED1  7.68,17.24 0 top
LED2  20.48,17.24 0 top
LED3  33.28,17.24 0 top
LED4  46.08,17.24 0 top
LED5  58.88,17.24 0 top
LED6  71.68,17.24 0 top
OK100  8.12,61.04 0 bottom
Q100  73.51,75.59 90 bottom
Q101  65.16,30.85 180 bottom
R100  66.2,103.35 0 bottom
R101  63.18,103.35 0 bottom
R102  66.16,101.19 0 bottom
R103  73.35,100.55 180 bottom
R104  16.87,95.12 270 bottom
R105  76.65,86.58 270 bottom
R106  16.77,85.29 90 bottom
R107  25.61,75.67 270 bottom
R108  35.69,75.59 270 bottom
R109  17.14,71.6 180 bottom
R110  35.08,71.44 0 bottom
R111  32.07,71.44 0 bottom
R112  29.05,71.44 0 bottom
R113  26.04,71.44 180 bottom
R114  17.17,69.56 0 bottom
R115  26.04,69.37 0 bottom
R116  35.22,69.34 180 bottom
R117  10.64,69.06 180 bottom
R118  38.73,65.41 0 bottom
R119  43.66,63.5 180 bottom
R120  55.24,63.18 0 bottom
R121  38.76,62.19 180 bottom
R122  55.24,61.12 0 bottom
R123  24.27,59.74 180 bottom
R124  17.32,59.72 0 bottom
R125  36.51,59.69 0 bottom
R126  30.32,59.69 0 bottom
R127  27.78,59.21 270 bottom
R128  20.34,57.66 0 bottom
R129  33.5,57.63 0 bottom
R130  24.31,57.58 0 bottom
R131  46.83,57.31 180 bottom
R132  43.66,57.31 180 bottom
R133  58.34,53.55 90 bottom
R134  45.84,53.55 90 bottom
R135  33.34,53.55 90 bottom
R136  20.34,53.55 90 bottom
R137  11.21,52.17 90 bottom
R138  42.23,49.69 180 bottom
R139  49.21,49.53 0 bottom
R140  37.47,49.53 0 bottom
R141  29.69,49.53 180 bottom
R142  23.65,49.53 180 bottom
R143  16.35,49.53 0 bottom
R144  61.59,49.37 0 bottom
R145  55.24,49.37 180 bottom
R146  52.73,47.03 180 bottom
R147  27.44,46.72 180 bottom
R148  14.79,46.64 180 bottom
R149  41.46,46.48 180 bottom
R150  27.46,44.61 0 bottom
R151  27.48,42.43 180 bottom
R152  51.75,39.53 180 bottom
R153  12.22,35.4 0 bottom
R154  24.92,35.08 0 bottom
R155  65.25,34.45 0 bottom
R156  65.25,27.46 0 bottom
R157  67.63,18.1 270 bottom
R158  3.49,18.1 270 bottom
R159  54.29,17.94 270 bottom
R160  28.89,17.94 270 bottom
R161  15.72,17.94 270 bottom
R162  41.43,17.78 270 bottom
R163  76.99,5.87 90 bottom
R164  13.97,5.87 90 bottom
R165  52.39,5.71 90 bottom
R166  39.21,5.56 90 bottom
R167  26.83,5.56 90 bottom
R168  65.41,5.4 90 bottom
S1  7.62,6.87 0 top
S2  20.42,6.85 0 top
S3  33.22,6.85 0 top
S4  46.02,6.85 0 top
S5  58.82,6.85 0 top
S6  71.62,6.85 0 top
SW1  69.87,59.88 0 top
U100  71.12,85.82 90 bottom
U$1  7.5,45.5 0 top

### Tracks (layer width: path | path; a pad name or v marks a point on that pad's centre or on a via)
5V_ACCURATE  (via drill 0.35)
  Top 0.203: v22.03,56.64 23.74,54.93 v27.62,54.93 28.19,54.36 36.22,54.36 36.92,53.66 v40.96,53.66 42.23,54.93 51.75,54.93 v53.98,52.7
  Top 0.254: v22.03,56.64 25.72,60.33 v25.72,61.91
  Bottom 0.203: R143.1 20.41,52.73 20.68,52.73 22.03,54.09 v22.03,56.64 | R141.1 27.62,50.74 v27.62,54.93 | R138.1 40.96,50.11 v40.96,53.66 | R145.1 53.98,49.79 v53.98,52.7
  Bottom 0.254: R123.2 24.83,60.02 IC106.1 24.96,61.91 v25.72,61.91 | R128.1 22.03,56.82 v22.03,56.64
+5V  (via drill 0.35)
  Top 0.203: R103.1 73.66,97.7 73.66,92.59 72.47,91.39 72.47,87.87 73.66,86.67 U100.2
  Top 0.254: v56.36,82.23 55.29,81.17 53.02,81.17 | v54.13,78.74 54.13,78.9 53.02,80.01 53.02,81.17 | v14.13,80.8 20.48,87.15 v30.16,87.15 36.15,81.17 40.48,81.17 | 53.02,81.17 40.48,81.17 | DS1.3 40.48,81.17 | 40.48,81.17 | v48.74,63.18 v48.74,57.63
  Bottom 0.203: C113.1 IC105.5 61.37,75.65 | R105.2 73.75,85.73 U100.2 | 70.17,101.19 R103.1 70.81,96.1 66.04,91.33 65.42,91.33 IC102.1 63.01,88.91 62.48,88.39 62.05,88.39 56.93,83.27 IC105.38 57.23,80.35 57.23,79.8 61.37,75.65 | R164.2 26.51,6.72 R167.2 R166.2 52.23,6.41 R165.2 65.09,6.57 R168.2 76.52,6.25 R163.2 | 61.37,75.65 61.84,75.18 57.73,71.06 IC105.17 | IC108.8 46.81,63.18 | IC105.27 50.47,74.05 C115.1 49.26,71.58 48.58,70.91 48.58,68.58 48.42,68.42 48.42,63.5 v48.74,63.18 | C127.1 67.84,46.19 | IC109.10 67.91,46.13 67.91,45.22 69.62,43.5 74.61,43.5 75.59,44.48 75.59,46.06 | C120.1 46.89,63.18 46.99,63.18 | v14.13,80.8 12.86,82.07 C110.1
  Bottom 0.254: C110.1 12.28,81.6 12.82,81.06 IC104.16 15.34,77.13 15.34,74.97 13.55,73.18 13.55,71.12 R117.2 11.49,68.74 11.77,68.46 11.77,65.97 OK100.8 12.22,65.52 12.22,58.17 13.01,57.39 13.01,55.16 12.29,54.44 12.29,8.4 R164.2 | R100.1 68.01,103.35 70.17,101.19 | C126.1 76.57,47.28 IC109.16 75.59,46.06 76.99,44.66 R163.2 | 67.84,46.19 IC109.10 | R168.2 65.41,26.45 R156.2 | IC105.38 56.93,81.66 v56.36,82.23 | v54.13,78.74 54.15,78.72 54.15,74.84 53.36,74.05 IC105.27 | v48.74,63.18 46.99,63.18 46.81,63.18 | 44.63,65.69 C120.1 | R131.2 48,57.63 v48.74,57.63
  Bottom 0.406: C103.+ 61.17,94.52 C106.1 63.01,89.13 63.01,88.91 | v30.16,87.15 30.8,87.79 C104.1 30.75,93.08 IC100.2 32.11,96.82 33.94,96.82 34.79,95.97 C101.+
-5V_ACCURATE  (via drill 0.35)
  Top 0.203: v16.51,57.94 16.51,56.94 19.09,54.36 19.09,53.14 v21.75,50.48 22.7,51.44 33.97,51.44 35.88,49.53 v39.37,49.53 41.43,51.59 46.99,51.59 49.05,49.53 v51.12,49.53 52.67,51.09 61.96,51.09 62.55,50.5 v62.55,50.48
  Bottom 0.203: R142.1 22.7,49.53 v21.75,50.48 | v16.51,57.94 16.48,57.98 R124.2 | R140.1 v39.37,49.53 | R139.1 v51.12,49.53 | R144.1 62.45,50.38 v62.55,50.48
  Bottom 0.254: R124.2 16.48,61.3 IC106.7
ADC
  Bottom 0.203: R119.2 C121.2
  Bottom 0.254: C121.2 44.91,61.84 IC108.7 46.89,61.92 48.65,61.92 53.18,66.45 53.18,70.65 53.23,70.7 56.19,73.66 56.2,73.66 56.2,80.58 IC105.37
CLOCK_OUT
  Bottom 0.254: IC105.13 60.93,66.33 65.66,61.6 65.66,57.78 63.73,55.85 63.73,38.17 58.9,33.34 29.05,33.34 25.72,36.67 14.34,36.67 R153.1
DAC_CV
  Bottom 0.254: R107.2 R107.3 23.07,78.88 | IC102.6 55.59,86.53 54.48,85.42 35.36,85.42 30.11,80.17 23.6,80.17 23.07,79.64 23.07,78.88 | 23.07,78.88
DAC_TONE
  Bottom 0.203: IC102.8 52.75,89.07 C107.+
ENC_A  (via drill 0.35)
  Top 0.203: SW1.A 67.37,63.17 59.9,70.64 54.93,70.64 v54.61,70.96
  Bottom 0.203: IC105.21 54.53,71.04 v54.61,70.96
ENC_B  (via drill 0.35)
  Top 0.203: v55.56,71.28 55.72,71.12 60.14,71.12 71.1,60.16 71.1,53.65 SW1.B
  Bottom 0.254: v55.56,71.28 55.56,70.64 55.33,70.41 IC105.20
ENC_CLICK  (via drill 0.35)
  Top 0.203: v58.74,74.93 64.32,74.93 SW1.E
  Bottom 0.203: IC105.19 56.27,69.19 56.27,70.11 58.74,72.58 v58.74,74.93
GATE_IN
  Bottom 0.203: R156.1 65.16,28.41 Q101.C 65.16,53.56 | 66.11,68.27 IC105.11
  Bottom 0.254: 66.11,68.27 66.11,65.25 66.7,64.66 66.7,55.11 65.16,53.56
GATE_OUT
  Bottom 0.254: R154.1 28,32.86 59.21,32.86 64.45,38.1 64.45,56 66.29,57.84 66.29,64.49 IC105.12
GND  (via drill 0.35)
  Bottom 0.203: IC108.3 IC108.4
  other vias: 33.66,81.28 40.32,82.23 57.47,76.99 60.17,78.42 6.35,75.72 62.07,63.02 63.18,65.41 72.87,56.36 56.52,72.23 55.09,66.36 49.05,68.1 24.77,74.45 58.9,5.56 45.72,5.4 20.32,5.08 5.24,18.41 67.94,83.98 66.52,85.88 62.71,81.92 28.26,56.2 31.91,55.4 38.42,54.77 20.48,90.65 12.86,90.01 58.9,83.03 45.56,55.56 41.12,66.67 26.04,66.67 21.11,84.14 25.56,53.34 23.65,52.23 65.72,55.56
  pour Bottom: 81.44,107.31 -0.64,107.31 -1.75,106.2 -1.75,-1.11 79.85,-1.11 80.01,-1.27 80.01,106.05 80.17,106.05
  pour Top: 80.8,107.31 80.8,-1.27 -1.75,-1.27 -1.91,-1.11 -1.91,107.47 -1.75,107.63 80.49,107.63
IO_ENABLE  (via drill 0.35)
  Top 0.254: v12.7,75.22 17.28,70.64 v49.21,70.64 | v51.91,69.37 52.7,70.17 59.53,70.17 60.64,69.06 60.64,57.2 69.09,48.76 v70.48,48.76
  Bottom 0.254: IC109.12 70.39,48.67 v70.48,48.76 | v51.91,69.37 51.91,70.83 IC105.23 51.72,70.64 v49.21,70.64 | v12.7,75.22 12.82,75.1 IC104.1
IO_INPUT  (via drill 0.35)
  Top 0.254: v4.13,77.95 5.78,77.95 6.12,78.29 13.47,78.29 18.57,73.18 46.2,73.18 50.48,77.47 v54.93,77.47
  Bottom 0.254: IC104.9 3.93,78.14 v4.13,77.95 | v54.93,77.47 54.88,77.42 54.88,73.61 53.72,72.45 IC105.25
IO_OUTPUT  (via drill 0.35)
  Top 0.254: v72.87,49.21 71.28,47.62 69.01,47.62 58.81,57.83 58.81,64.54 56.06,67.29 52.12,67.29 50.46,68.94 50.46,71.3 v50.32,71.44
  Bottom 0.254: IC109.14 72.94,49.14 v72.87,49.21 | v50.32,71.44 50.54,71.65 IC105.24
IO_SCK  (via drill 0.35)
  Top 0.254: v14.29,75.72 17.8,72.21 52.55,72.21 v53.66,73.32 53.82,73.32 54.05,73.09 58.87,73.09 73.72,58.24 73.72,51.83 73.66,51.77 v73.66,50.8
  Bottom 0.254: v53.66,73.32 53.63,73.3 51.98,73.3 IC105.26 | v14.29,75.72 13.13,75.72 12.97,75.88 12.43,75.88 12.04,75.5 12.04,73.99 IC104.2 | v73.66,50.8 72.73,49.87 70.67,49.87 69.12,48.33 IC109.11
LCD_DATA4
  Bottom 0.203: IC105.33 44.33,78.85 43.85,78.37 29.37,78.37 DS1.11
LCD_DATA5
  Bottom 0.203: IC105.32 44.16,78.05 43.85,77.74 28.5,77.74 DS1.12
LCD_DATA6
  Bottom 0.203: IC105.31 27.49,77.25 DS1.13
LCD_DATA7
  Bottom 0.203: IC105.30 51.77,76.45 51.61,76.61 26.63,76.61 DS1.14
LCD_ENABLE
  Bottom 0.203: IC105.35 54.23,80.95 54.23,81.5 51.07,84.67 39.33,84.67 35.98,81.32 DS1.6
LCD_RS
  Bottom 0.203: IC105.34 50.87,83.51 40.21,83.51 38.98,82.28 DS1.4
MIDI_IN  (via drill 0.35)
  Top 0.254: v61.91,72.39 60.21,74.09 53.5,74.09 53,73.59 53,73.48 52.23,72.71 18.23,72.71 14.56,76.38 12.93,76.38 10.67,74.13 10.64,74.13 10.64,66.99 v6.83,63.18
  Bottom 0.254: R117.1 9.14,69.06 6.85,66.76 OK100.6 6.85,63.2 v6.83,63.18 | IC105.9 61.97,72.45 v61.91,72.39
MISO
  Bottom 0.203: IC105.2 63.53,78.23 63.65,78.35 64.39,78.35 64.53,78.5 64.53,79.23 U100.1
MOSI
  Bottom 0.203: 73.04,88.36 U100.4 | IC105.1 63.53,80.87 69.67,87.01 71.69,87.01 73.04,88.36 | IC102.4 63.33,85.42 64.43,85.42 68.56,89.55 71.61,89.55 72.81,88.36 73.04,88.36
N$1  (via drill 0.35)
  Top 0.254: v67.63,29.05 67.63,27.94 62.88,23.2 62.88,23.34 60.18,20.64 29.21,20.64 v28.89,20.95
  Bottom 0.254: v67.63,29.05 69.38,30.8 69.38,31.41 70.69,32.72 71.64,32.72 74.2,35.28 IC109.2 | v28.89,20.95 R160.1
N$2  (via drill 0.35)
  Top 0.254: v71.44,37.78 70.35,36.69 69.26,36.69 60.8,28.23 60.8,23.97 59.37,22.54 54.45,22.54 v54.29,22.38
  Bottom 0.254: IC109.4 71.67,38.01 v71.44,37.78 | v54.29,22.38 R159.1
N$3
  Bottom 0.203: LED5.A 54.44,17.24 R159.2
N$4
  Bottom 0.203: Q100.1 70.13,70.76 C116.2 66.72,70.92 64.39,73.25 IC105.8
N$5
  Bottom 0.203: R155.1 66.57,34.92 J10.P3
N$6  (via drill 0.35)
  Top 0.254: J9.P3 58.82,36.42 65.05,42.66 65.05,50.56 56.88,58.74 v56.04,58.74
  Bottom 0.203: C128.+ 57.76,35.98 J9.P3
  Bottom 0.254: v56.04,58.74 56.04,61.06 R122.1
N$7
  Bottom 0.254: R137.1 10.14,50.26 U$1.P3
N$8
  Bottom 0.254: IC107.8 26.89,68.75 R115.1
N$9  (via drill 0.35)
  Top 0.203: S5.4 S5.3
  Top 0.254: S5.3 50.99,4.59 48.35,7.23 15.67,7.23 7.35,15.55 7.35,17.63 3.04,21.95 3.04,70.09 9.62,76.68 v10.32,76.68
  Bottom 0.203: R168.1 62.11,4.55 S5.4
  Bottom 0.254: v10.32,76.68 10.32,73.54 IC104.3
N$10
  Bottom 0.254: R127.1 27.78,61.17 IC107.7
N$11
  Bottom 0.203: R153.2 10.9,34.92 J5.P3
N$12  (via drill 0.35)
  Top 0.203: S6.4 S6.3
  Top 0.254: v9.21,75.25 8.77,75.25 3.44,69.92 3.44,22.12 7.76,17.8 7.76,15.75 15.88,7.64 60.75,7.64 63.8,4.59 S6.3
  Bottom 0.203: R163.1 75.31,5.02 S6.4
  Bottom 0.254: IC104.4 9.01,75.05 v9.21,75.25
N$13  (via drill 0.35)
  Top 0.203: S4.4 S4.3
  Top 0.254: S4.3 40.53,6.83 15.5,6.83 2.63,19.7 2.63,70.26 v10,77.63
  Bottom 0.203: R165.1 49.55,4.87 S4.4
  Bottom 0.254: v10,77.63 10,79.37 IC104.14
N$14
  Bottom 0.203: R154.2 23.91,34.92 J6.P3
N$15
  Bottom 0.254: IC107.2 34.87,60.61 35.18,60.31 35.18,60.18 R125.2 36.51,60.53 36.56,60.53 36.72,60.7 36.72,61 R121.1
N$16
  Bottom 0.254: R151.2 29.13,43.23 29.13,45.06 33.38,49.31 J2.P3
N$17  (via drill 0.35)
  Top 0.254: v36.51,57.47 36.51,64.45 v41.27,69.22 | v44.13,75.41 44.13,77.95 v46.2,80.01 | v46.51,82.39 46.51,87.95 v47.62,89.06
  Bottom 0.254: R129.1 36.35,57.63 v36.51,57.47 | v41.27,69.22 41.27,72.55 v44.13,75.41 | v46.2,80.01 46.2,82.07 v46.51,82.39 | v47.62,89.06 47.78,89.22 C107.-
N$18
  Bottom 0.254: J1.P3 16.94,46.64 R148.2
N$19
  Bottom 0.203: LED6.A R157.2
N$20
  Bottom 0.203: Q100.2 73.51,79.66 73.18,79.04 C111.2 69.41,78.53 69.41,76.33 67.04,73.96 63.62,73.96 IC105.7
N$21  (via drill 0.35)
  Top 0.254: v69.53,36.04 69.53,31.57 69.38,31.41 69.38,24.13 v67.63,22.38
  Bottom 0.254: IC109.5 70.39,36.9 v69.53,36.04 | v67.63,22.38 R157.1
N$22
  Bottom 0.203: C114.1 50.16,75.95 51.63,75.95 IC105.29
N$23
  Bottom 0.254: IC107.6 29.79,61.07 R126.1 C125.1 R129.2
N$24  (via drill 0.35)
  Top 0.203: S1.4 S1.3
  Top 0.254: v4.13,76.83 3.97,76.68 3.97,76.14 1.34,73.51 1.34,7.64 S1.3
  Bottom 0.203: R164.1 11.28,5.02 S1.4
  Bottom 0.254: IC104.11 5.81,78.99 5.81,78.52 5.65,78.35 5.64,78.35 v4.13,76.83
N$25
  Bottom 0.203: DS1.15 65.38,101.12 R102.2
N$26  (via drill 0.35)
  Top 0.254: v29.53,47.47 29.53,38.62 J7.P3
  Bottom 0.254: R112.2 C119.2 27.66,69.91 27.66,70.04 27.5,70.2 26.27,70.2 25.44,69.37 R115.2 27.04,67.52 27.04,60.77 26.95,60.68 26.95,57.53 26.95,49.09 28.26,47.78 29.21,47.78 v29.53,47.47
N$27
  Bottom 0.254: IC107.9 29.79,69.27 C119.1 R112.1 | R112.1 R111.2 | R112.1 29.65,71.44 28.82,72.27 27.59,72.27 27.42,72.1 27.42,71.97 R113.2
N$28
  Bottom 0.203: D102.C 8.86,53.02 | 8.86,53.02 8.86,55.75 OK100.2 | R137.2 8.86,53.02
N$29
  Bottom 0.254: R107.1 28.15,74.4 R113.1
N$30  (via drill 0.35)
  Top 0.254: v10.95,19.68 11.77,18.87 67.92,18.87 74.3,25.24 74.3,43.97 v74.14,44.13
  Bottom 0.254: R158.1 4.23,19.68 v10.95,19.68 | v74.14,44.13 74.14,46.11 IC109.15
N$31  (via drill 0.35)
  Top 0.254: v15.56,20.48 16.21,19.82 62.05,19.82 67.79,25.56 v67.79,25.72
  Bottom 0.254: IC109.1 75.47,29.51 72.1,26.14 68.2,26.14 v67.79,25.72 | v15.56,20.48 15.72,20.32 R161.1
N$32
  Bottom 0.254: R108.1 38.23,73.73 R110.1
N$33  (via drill 0.35)
  Top 0.254: v68.26,31.75 61.68,25.17 61.68,23.64 59.63,21.59 v41.43,21.59
  Bottom 0.254: v68.26,31.75 70.27,33.76 72.1,33.76 72.94,34.59 IC109.3 | v41.43,21.59 R162.1
N$34  (via drill 0.35)
  Top 0.254: R103.2 49.94,103.09 41.91,95.06 v41.91,82.55
  Bottom 0.254: DS1.2 41.91,79.33 v41.91,82.55
N$35
  Bottom 0.254: R110.2 R111.1
N$36
  Bottom 0.152: IC108.5 44.58,59.3 C124.1
  Bottom 0.203: C124.1 R132.2 R131.1
N$37
  Bottom 0.254: IC108.2 52.7,61.14 53.23,61.14 53.25,61.12 R122.2 54.4,61.48 R120.1
N$38
  Bottom 0.152: C121.1 43.13,61.44 43.86,60.71 46.67,60.71 IC108.6
  Bottom 0.203: R119.1 C121.1
  Bottom 0.254: IC108.6 46.87,60.51 48.34,60.51 52.69,56.17 52.69,39.61 R152.2
N$39
  Bottom 0.203: R147.2 27.53,45.96 27.53,43.33
  Bottom 0.254: 27.53,43.33 R151.1 | IC106.14 24.83,65.07 26.48,63.42 26.48,48.54 R147.2
N$40
  Bottom 0.203: R152.1 51.02,39.41 C128.-
N$41  (via drill 0.35)
  Top 0.254: v40.8,56.04 40.32,56.04 40.16,55.88 v39.21,55.88
  Bottom 0.254: R116.2 36.07,67.19 IC107.14 37.02,66.23 38.5,66.23 38.66,66.07 38.66,64.58 40.39,62.85 40.39,56.45 v40.8,56.04 | v39.21,55.88 39.21,55.09 40.16,54.13 40.16,46.92 R149.1
N$42
  Bottom 0.203: LED1.A R158.2
N$43
  Bottom 0.203: LED2.A 15.87,17.24 R161.2
N$44
  Bottom 0.203: LED3.A 29.04,17.24 R160.2
N$45
  Bottom 0.203: R162.2 44.5,16.93 LED4.A
N$46
  Bottom 0.254: R109.2 18.02,71.58 R114.1 18.02,67.7 IC106.9
N$47
  Bottom 0.254: R114.2 17.21,68.67 IC106.8 17.21,64.78 13.94,61.5 R148.1
N$48
  Bottom 0.254: R150.2 26.59,44.63 R147.1 25.32,47.99 25.32,51.48 24.35,52.45 24.35,55.24 22.64,56.96 22.64,60.4 22.98,60.75 22.98,63.25 23.56,63.83 IC106.13
N$49
  Bottom 0.254: IC106.2 23.56,59.88 R123.1 23.42,57.62 R130.2
N$50
  Bottom 0.254: R128.2 18.18,58.97 R124.1 18.18,61.73 IC106.6
N$51
  Bottom 0.254: R118.2 35.4,65.41 34.77,66.04 34.77,67.01 IC107.13 34.69,67.3 34.69,69.02 R116.1
N$52  (via drill 0.35)
  Top 0.254: v14.45,64.45 15.1,63.8 15.1,62.91 20.34,57.67 R136.2
  Bottom 0.254: R109.1 16.3,70.99 15.54,70.23 15.54,65.54 v14.45,64.45
N$53
  Bottom 0.254: R149.2 45.77,49.95 J3.P3
N$54
  Bottom 0.254: J4.P3 55.71,47.03 R146.2
N$55
  Bottom 0.203: 51.88,50.21 51.88,51.2 48.72,54.36 47.8,54.36 46.18,52.73 45.51,52.73 43.47,54.77 40.48,54.77 39.93,55.32 39.93,55.74
  Bottom 0.254: IC107.1 37.25,63.02 38.52,63.02 39.35,62.19 R121.2 39.93,61.87 39.93,55.74 | R146.1 51.88,50.21
N$56
  Bottom 0.406: J100.1 J100.2 3.69,99.67 D100.A
N$57
  Bottom 0.203: R150.1 28.63,44.93 28.63,45.4 31.91,48.69 31.91,52.16 33.3,53.55 R135.2
N$58  (via drill 0.35)
  Top 0.254: v38.26,58.26 39.69,56.83 53.95,56.83 57.23,53.55 R133.2
  Bottom 0.254: R125.1 38.26,58.79 v38.26,58.26
N$59
  Bottom 0.254: R118.1 39.59,64.45 40.96,63.08 40.96,57.08 42.42,55.61 44.09,55.61 45.84,53.87 R134.2
N$60
  Bottom 0.254: R101.1 R100.2 65.35,102.85 R102.1
N$61
  Bottom 0.203: R142.2 22.88,51.15 R136.3
N$62
  Bottom 0.203: R136.1 17.8,51.83 R143.2
N$63
  Bottom 0.203: R140.2 36.62,52.86 35.93,53.55 R135.3
N$64
  Bottom 0.406: J100.9 J100.10 3.71,88.13 D101.C
N$65
  Bottom 0.203: R141.2 30.54,53.28 R135.1
N$66
  Bottom 0.203: Q101.B 64.2,34.26 R155.2
N$67
  Bottom 0.203: R139.2 48.36,53.53 R134.3
N$68
  Bottom 0.203: R138.2 43.08,53.32 R134.1
N$69
  Bottom 0.203: R144.2 60.74,53.41 R133.3
N$70
  Bottom 0.203: R145.2 56.09,53.25 R133.1
N$73
  Bottom 0.254: OK100.3 6.85,54.77 D102.A 5.06,44.45 U$1.P2
N$88  (via drill 0.35)
  Top 0.203: S2.4 23.35,4.27 17.49,4.27 S2.3
  Top 0.254: S2.3 13.36,4.59 1.75,16.2 1.75,73.34 6.03,77.63 v7.78,77.63
  Bottom 0.203: R167.1 23.79,4.71 S2.4
  Bottom 0.254: v7.78,77.63 7.74,77.67 IC104.12
N$90  (via drill 0.35)
  Top 0.203: S3.4 S3.3
  Top 0.254: v8.89,77.63 8.23,76.97 7.51,76.97 7.48,76.99 6.03,76.99 2.22,73.18 2.22,19.51 15.92,5.81 24.18,5.81 25.39,4.59 S3.3
  Bottom 0.203: R166.1 36.59,4.71 S3.4
  Bottom 0.254: IC104.13 9.01,77.75 v8.89,77.63
PITCH_DETECTOR
  Bottom 0.254: IC108.1 54.32,63.1 R120.2 59.33,68.12 IC105.15
REF_-4.096  (via drill 0.35)
  Top 0.254: R108.3 30.45,75.59 28.57,77.47 23.65,77.47 19.84,81.28 v19.84,82.55
  Bottom 0.254: R108.2 R108.3 | IC103.2 18.89,87.74 19.84,86.78 v19.84,82.55
  Bottom 0.406: R106.2 16.77,87.86 C108.1 16.89,87.74 IC103.2
REF_-5V
  Bottom 0.254: C105.1 22.7,86.89 22.7,83.96 19.19,80.44 19.19,79.42 22.23,76.38 22.23,75.32 24.25,73.3 24.25,58.48 R130.1
  Bottom 0.406: C105.1 16.87,92.76 R104.2 17.19,93.95 IC101.2
RESET  (via drill 0.35)
  Top 0.254: U100.5 67.15,90.9 61.59,85.34 v61.59,76.52
  Bottom 0.203: C112.1 65.58,77.64 64.39,76.45 IC105.4 | R105.1 74.37,89.71 73.17,89.71 71.97,90.9 U100.5
  Bottom 0.254: v61.59,76.52 63.46,76.52 IC105.4
SCK
  Bottom 0.203: IC105.3 63.23,77.55 62.67,77.55 62.53,77.69 62.53,80.37 63.87,81.71 | U100.3 70.52,88.36 63.87,81.71 | IC102.3 62.48,85.84 62.05,85.84 61.9,85.7 61.9,83.68 63.87,81.71
SS
  Bottom 0.203: IC102.2 62.48,87.11 62.05,87.11 61.54,86.61 61.54,83.53 61.73,83.34 IC105.44
TONE_OUT
  Bottom 0.254: C125.2 R126.2 | J8.P3 36.25,44.69 36.25,47.29 34.77,48.78 34.77,54.13 32.1,56.8 30.56,56.8 29.73,57.63 C125.2 | C125.2 28.52,57.63 R127.2
VCC  (via drill 0.35)
  Top 0.406: v20,79.85 20,78.11 v18.89,76.99 | v32.38,63.82 v21.11,63.82 16.35,63.82 v14.45,65.72
  Bottom 0.406: C123.1 32.33,60 IC107.4 32.38,61.97 v32.38,63.82 | C122.1 21.02,59.89 IC106.4 21.02,63.73 v21.11,63.82 | v20,79.85 28.47,88.32 IC100.3 28,95.93 C102.+ 19.8,95.93 C100.+ 12.54,103.18 D100.C | v18.89,76.99 18.89,76.38 14.49,71.98 14.49,66.63 14.45,66.59 v14.45,65.72
VEE  (via drill 0.35)
  Top 0.406: v20.95,65.56 32.07,65.56 v32.23,65.41
  Bottom 0.406: 11.56,84.62 10.14,83.2 D101.A | R104.1 11.56,90.66 11.56,84.62 | C118.2 32.44,68.9 32.44,67.22 IC107.11 32.23,67.01 v32.23,65.41 | v20.95,65.56 21.02,65.63 IC106.11 21.15,67.36 C117.2 21.15,76.4 17.05,80.5 17.05,82.83 16.77,83.11 R106.1 13.26,84.44 C109.- 11.56,84.62

### Text on the board
bDocu: Module Tester v1.00, copyright forestcaver 2020, / original design Emilie Gillet | Red Stripe